# Altium project HAWACO_DATALOGER_DT-G2_V1.0.3.PrjPcb
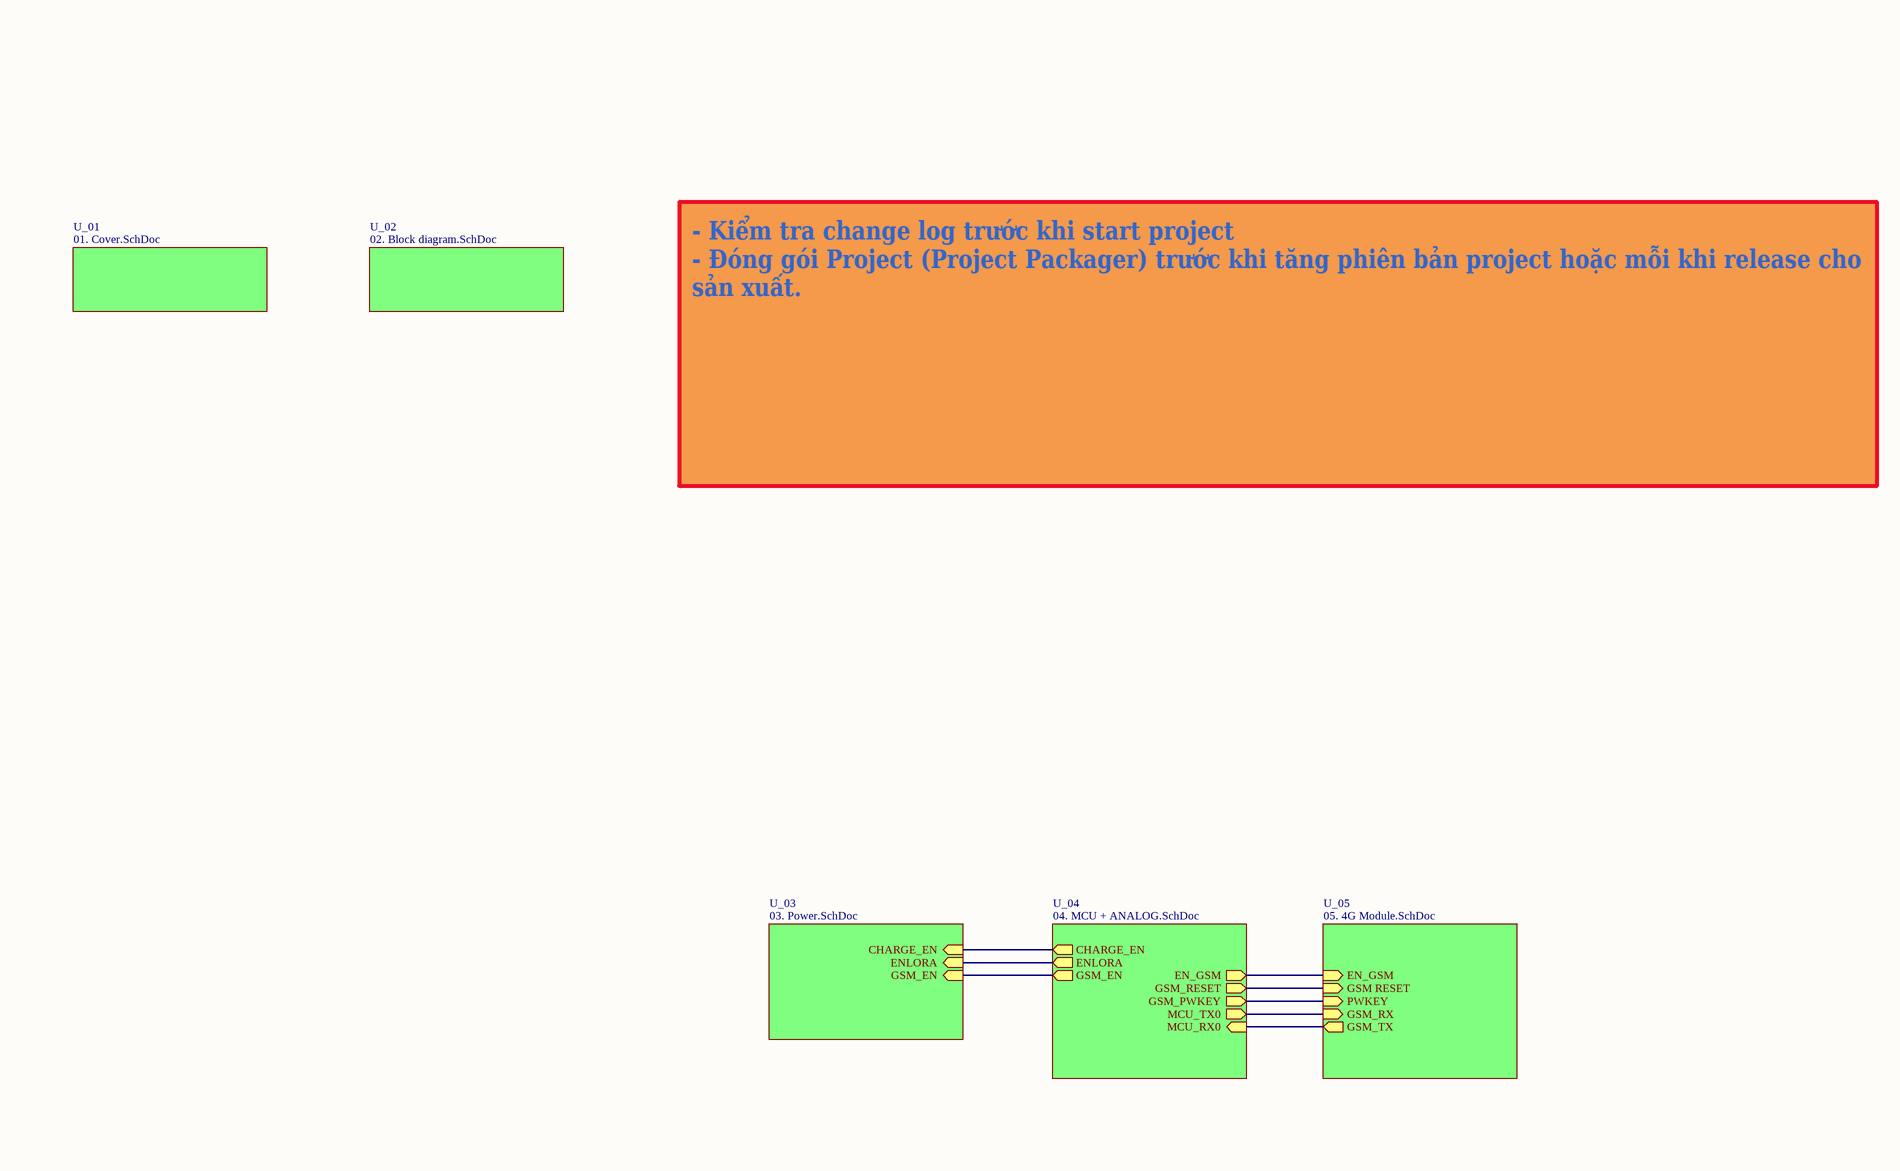
[diagram p0: 00. Root.SchDoc, left]
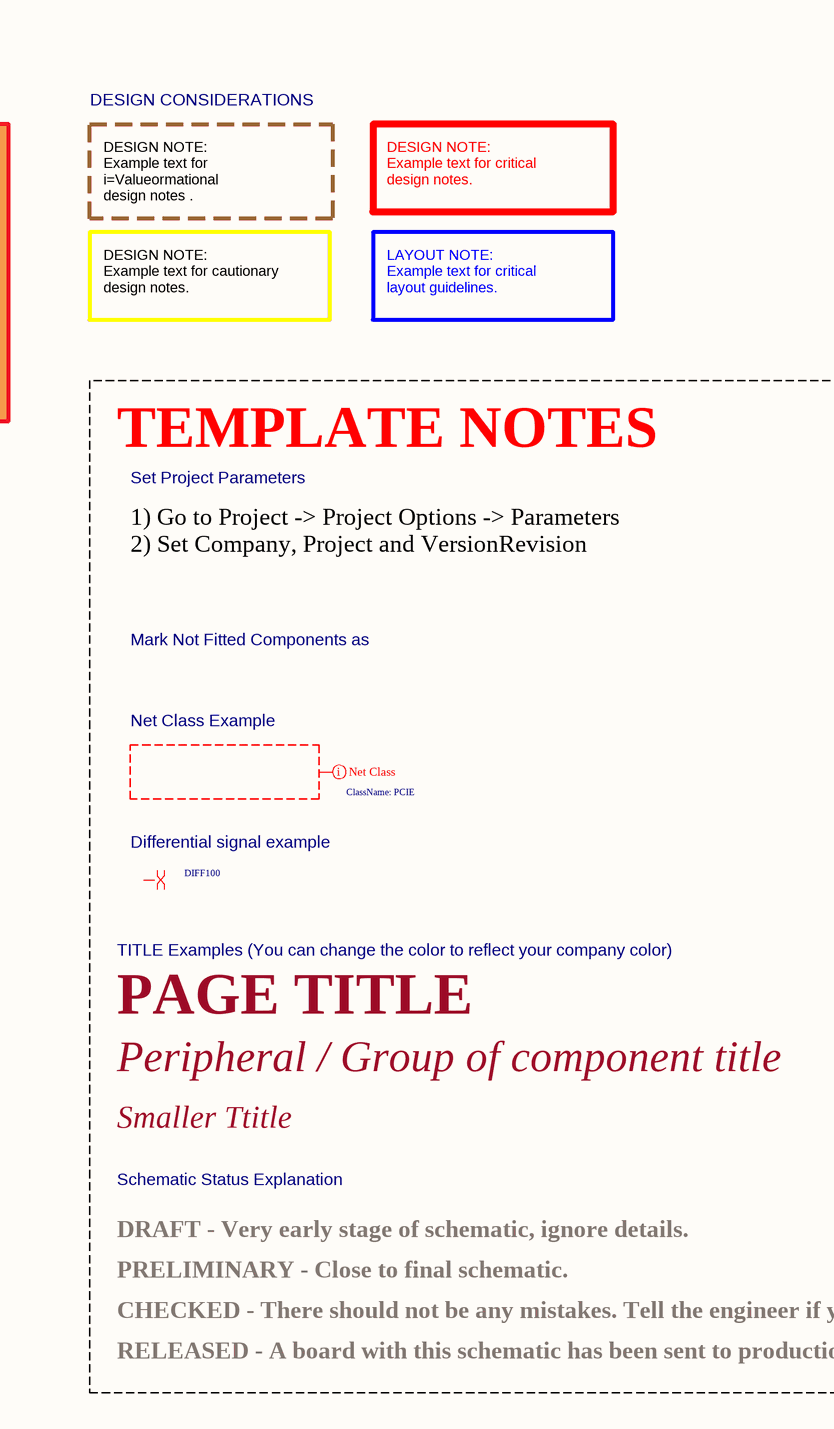
[diagram p1: 00. Root.SchDoc, right]
CURRENTREVISION: V1.0.3; globalprojectlink: HAWACO_DATALOGER_G2; GLOBALPROJECTTEAM: BUTPT
5 sheets, 286 parts. Net scope: hierarchical (ports join the sheet entries above them; power ports are global).
Board files: HAWACO_DATALOGER_DT-G2_PANEL.PcbDoc, HAWACO_DATALOGER_DT-G2_V1.0.3.PcbDoc
Sheets:
  00. Root.SchDoc
    U_01 = 01. Cover.SchDoc
    U_03 = 03. Power.SchDoc
    U_04 = 04. MCU + ANALOG.SchDoc
    U_05 = 05. 4G Module.SchDoc

## Sheet 00. Root.SchDoc
size A2

### Sub-sheets
U_01 = 01. Cover.SchDoc: no entries
U_02 = 02. Block diagram.SchDoc (file not in this document): no entries
U_03 = 03. Power.SchDoc: CHARGE_EN (in), ENLORA (in), GSM_EN (in)
U_04 = 04. MCU + ANALOG.SchDoc: GSM_PWKEY (out), GSM_EN (out), GSM_RESET (out), MCU_TX0 (out), MCU_RX0 (in), ENLORA (out), CHARGE_EN (out), EN_GSM (out)
U_05 = 05. 4G Module.SchDoc: GSM_RX (in), GSM_TX (out), GSM RESET (in), PWKEY (in), EN_GSM (in)

### Nets
EN_LORA: sheet U_03/ENLORA, sheet U_04/ENLORA
GSM1_RX: sheet U_04/MCU_TX0, sheet U_05/GSM_RX
GSM1_TX: sheet U_04/MCU_RX0, sheet U_05/GSM_TX
NetR3_2: sheet U_03/GSM_EN, sheet U_04/GSM_EN
NetR10_2: sheet U_03/CHARGE_EN, sheet U_04/CHARGE_EN
NetR28_1: sheet U_04/EN_GSM, sheet U_05/EN_GSM
NetR31_1: sheet U_04/GSM_RESET, sheet U_05/GSM RESET
NetR32_1: sheet U_04/GSM_PWKEY, sheet U_05/PWKEY

### Layout directives
net class PCIE: (no net found under the mark)
differential pair; net class DIFF100: (no net found under the mark)

### Notes on the sheet
- DESIGN CONSIDERATIONS
- DESIGN NOTE:
  Example text for i=Valueormational
  design notes .
- DESIGN NOTE:
  Example text for critical
  design notes.
- DESIGN NOTE:
  Example text for cautionary
  design notes.
- LAYOUT NOTE:
  Example text for critical
  layout guidelines.
- - Kiểm tra change log trước khi start project
  - Đóng gói Project (Project Packager) trước khi tăng phiên bản project hoặc mỗi khi release cho sản xuất.
- TEMPLATE NOTES
- Set Project Parameters
- 1) Go to Project -> Project Options -> Parameters
  2) Set Company, Project and VersionRevision
- Mark Not Fitted Components as
- Net Class Example
- Differential signal example
- TITLE Examples (You can change the color to reflect your company color)
- PAGE TITLE
- Peripheral / Group of component title
- Smaller Ttitle
- Schematic Status Explanation
- DRAFT - Very early stage of schematic, ignore details.
- PRELIMINARY - Close to final schematic.
- RELEASED - A board with this schematic has been sent to production.
- CHECKED - There should not be any mistakes. Tell the engineer if you find one.
- File:
- Project:
- REV:
- Sheet:
- Drawn By:
- Size:
- A2
- DRAFT
- Checked By:
- Approved By:

## Sheet 01. Cover.SchDoc
size A3
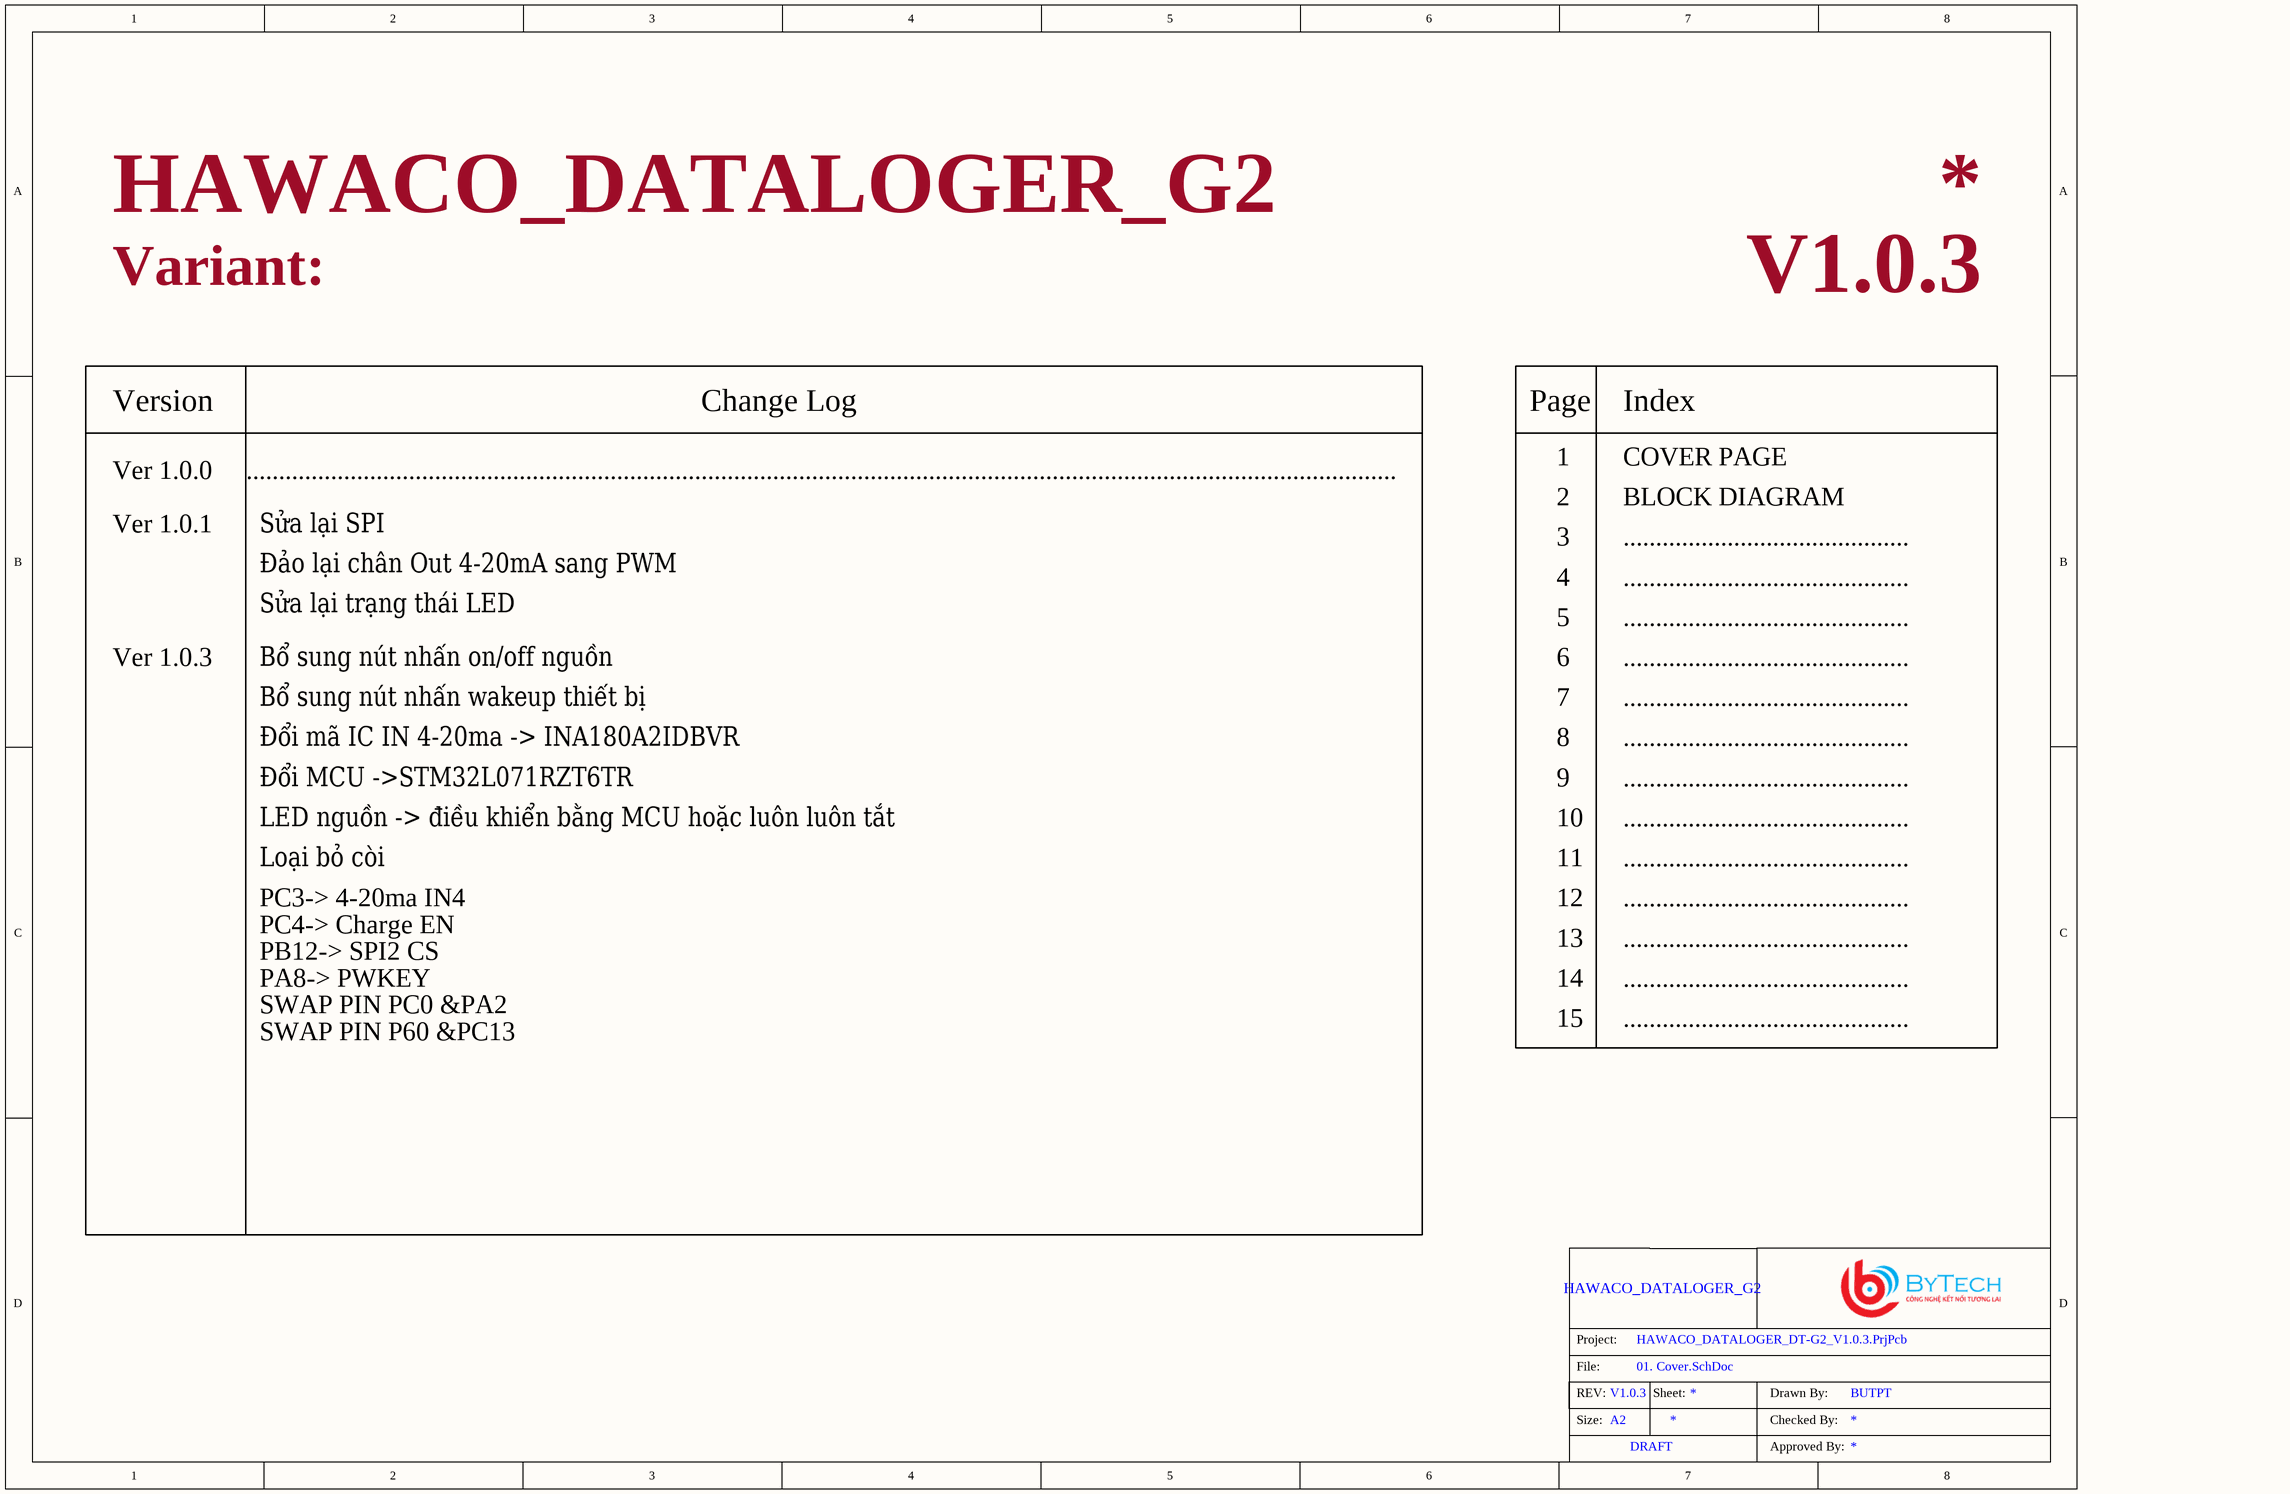
[diagram p2: 01. Cover.SchDoc]

### Notes on the sheet
- Variant:
- Version
- Change Log
- Page
- Index
- Ver 1.0.0
- .................................................................................................................................................................................
- 1
- 2
- COVER PAGE
- BLOCK DIAGRAM
- Ver 1.0.1
- Sửa lại SPI
- Đảo lại chân Out 4-20mA sang PWM
- 3
- ............................................
- Sửa lại trạng thái LED
- 4
- 5
- Ver 1.0.3
- Bổ sung nút nhấn on/off nguồn
- Bổ sung nút nhấn wakeup thiết bị
- 6
- 7
- Đổi mã IC IN 4-20ma -> INA180A2IDBVR
- 8
- Đổi MCU ->STM32L071RZT6TR
- LED nguồn -> điều khiển bằng MCU hoặc luôn luôn tắt
- 9
- 10
- Loại bỏ còi
- PC3-> 4-20ma IN4
- 11
- 12
- PC4-> Charge EN
- PB12-> SPI2 CS
- 13
- PA8-> PWKEY
- SWAP PIN PC0 &PA2
- SWAP PIN P60 &PC13
- 14
- 15
- File:
- Project:
- REV:
- Size:
- A2
- Sheet:
- Drawn By:
- Checked By:
- DRAFT
- Approved By:

## Sheet 03. Power.SchDoc
size A3
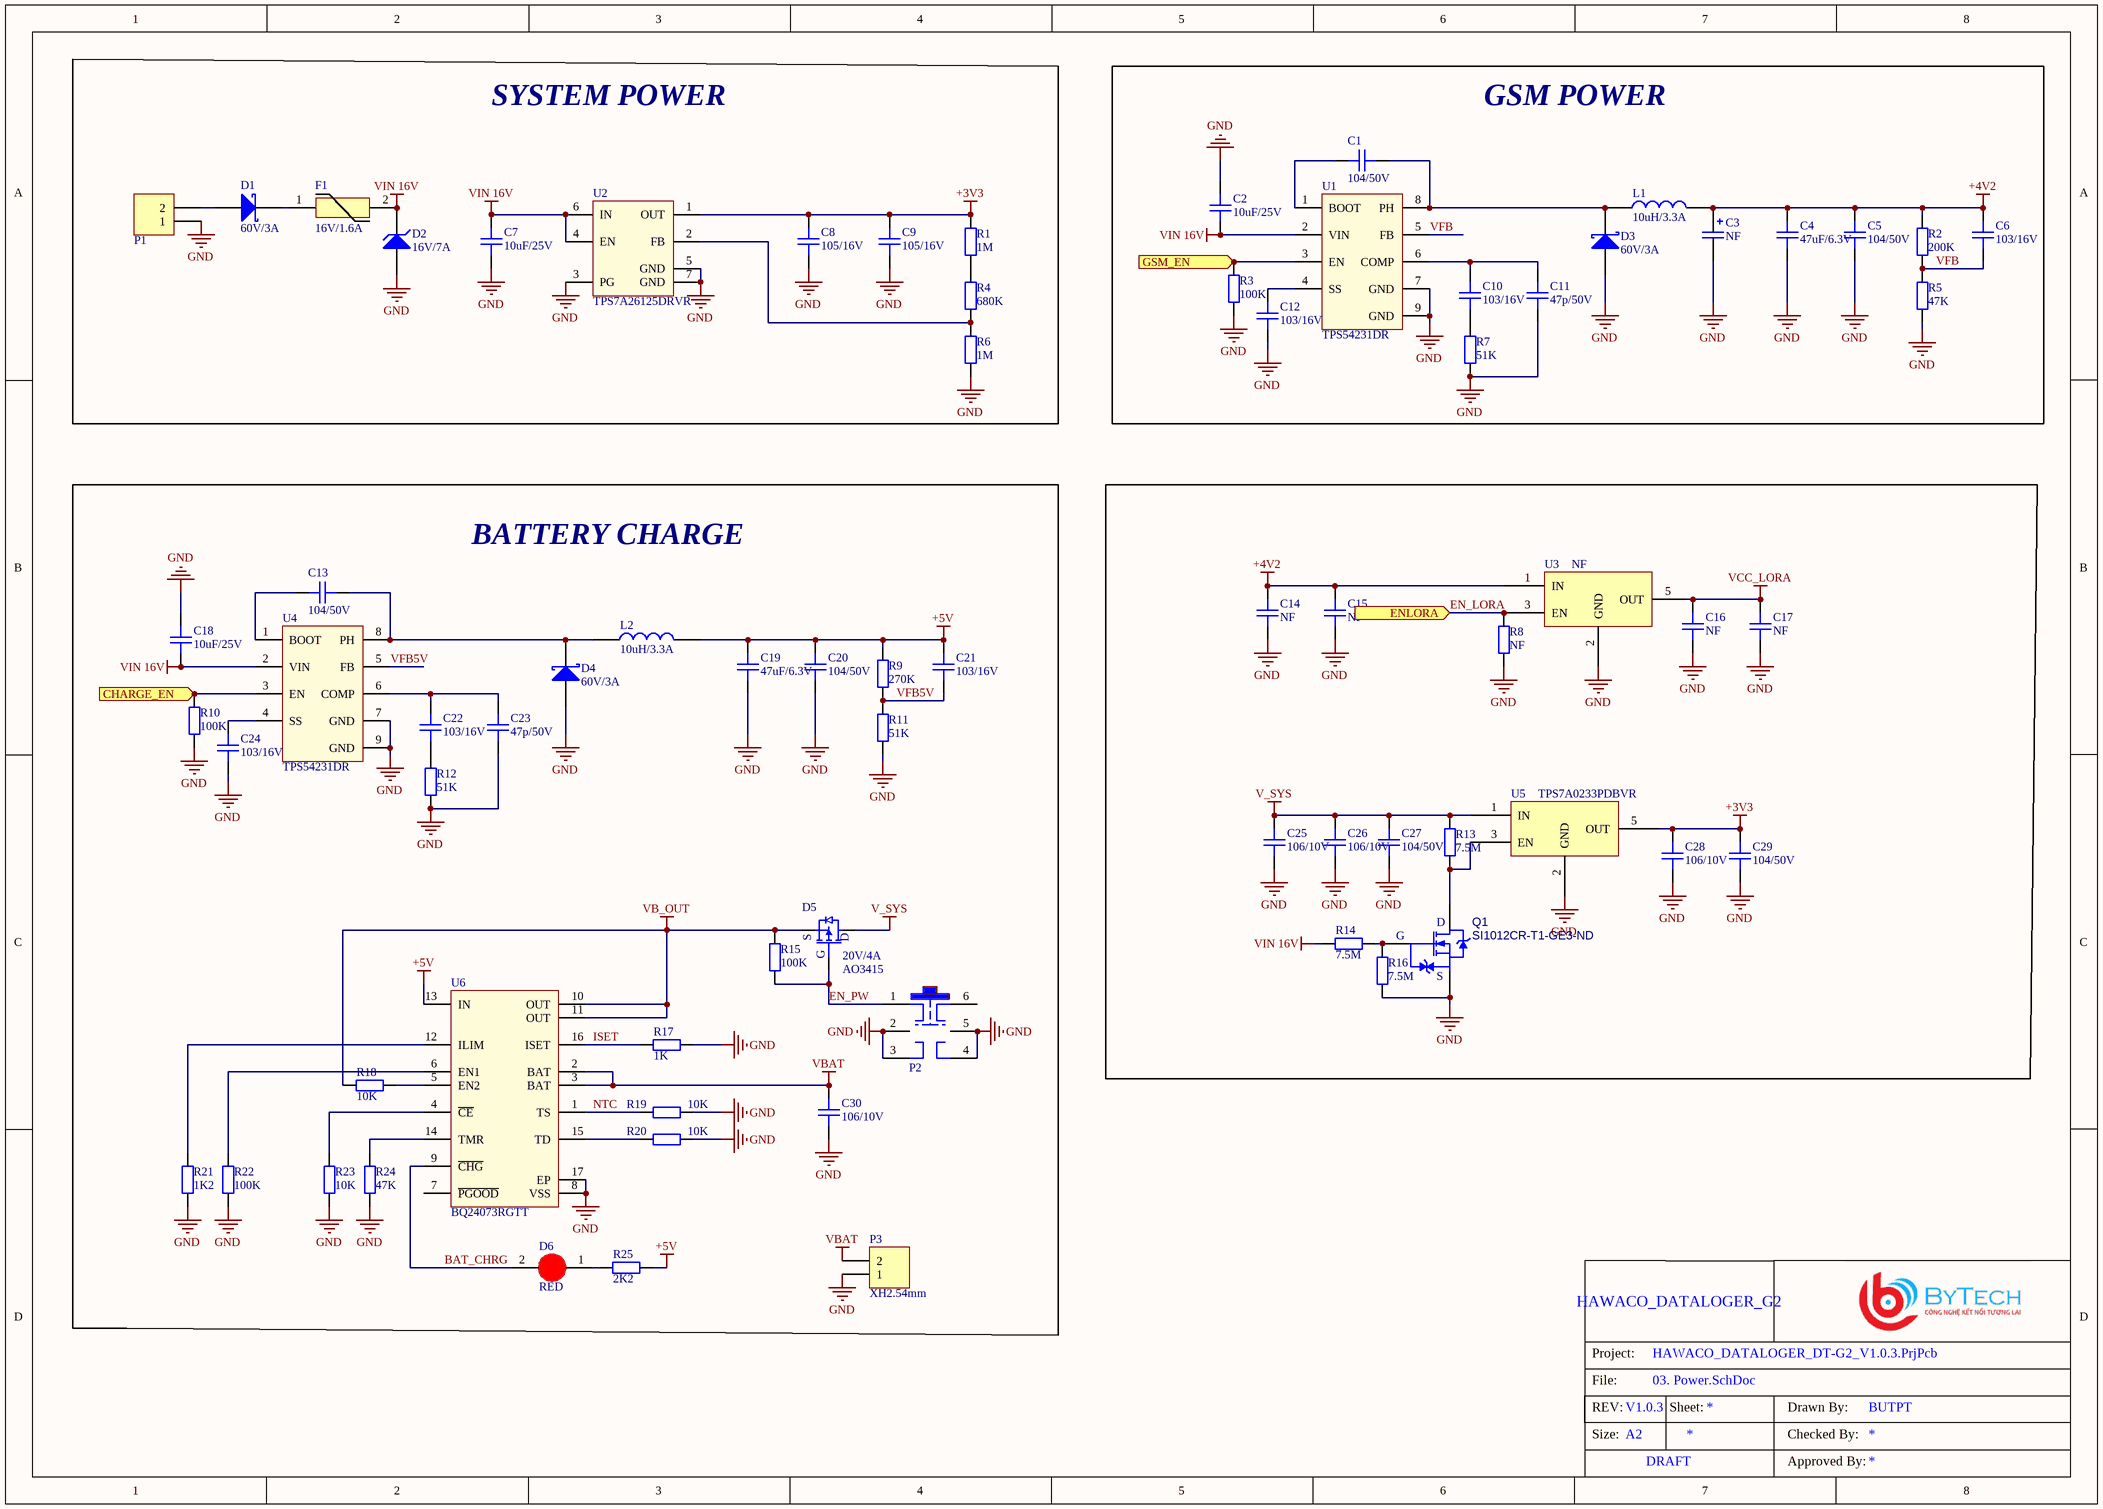
[diagram p3: 03. Power.SchDoc]

### Parts
C1  104/50V  [CAPC-0603 (1608)]
C2  10uF/25V  [CAPC-0805 (2012)]
C3  NF  [CAP_TANTAL_1210(3528)]
C4  47uF/6.3V  [CAPC-0603 (1608)]
C5  104/50V  [CAPC-0603 (1608)]
C6  103/16V  [CAPC-0603 (1608)]
C7  10uF/25V  [CAPC-0805 (2012)]
C8  105/16V  [CAPC-0603 (1608)]
C9  105/16V  [CAPC-0603 (1608)]
C10  103/16V  [CAPC-0603 (1608)]
C11  47p/50V  [CAPC-0603 (1608)]
C12  103/16V  [CAPC-0603 (1608)]
C13  104/50V  [CAPC-0603 (1608)]
C14  NF  [CAPC-0603 (1608)]
C15  NF  [CAPC-0603 (1608)]
C16  NF  [CAPC-0603 (1608)]
C17  NF  [CAPC-0603 (1608)]
C18  10uF/25V  [CAPC-0805 (2012)]
C19  47uF/6.3V  [CAPC-0603 (1608)]
C20  104/50V  [CAPC-0603 (1608)]
C21  103/16V  [CAPC-0603 (1608)]
C22  103/16V  [CAPC-0603 (1608)]
C23  47p/50V  [CAPC-0603 (1608)]
C24  103/16V  [CAPC-0603 (1608)]
C25  106/10V  [CAPC-0603 (1608)]
C26  106/10V  [CAPC-0603 (1608)]
C27  104/50V  [CAPC-0603 (1608)]
C28  106/10V  [CAPC-0603 (1608)]
C29  104/50V  [CAPC-0603 (1608)]
C30  106/10V  [CAPC-0603 (1608)]
D1  60V/3A  [DIODE_DO214AC_SMA]
D2  16V/7A  [SOD123]
D3  60V/3A  [DIODE_DO214AC_SMA]
D4  60V/3A  [DIODE_DO214AC_SMA]
D5  20V/4A  [SOT23_3]
D6  RED  [LED 0603]
F1  16V/1.6A  [FUSE_1812(4532)]
L1  10uH/3.3A  [IND-74404084150]
L2  10uH/3.3A  [IND-74404084150]
P1  15EDG3.81-2P  [HDR_3.81MM_RA_2x1]  (value not drawn)
P2  (no value)  [KFC8x8]
P3  XH2.54mm  [XH2.54-2P]
Q1  SI1012CR-T1-GE3-ND  [SOT-416]
R1  1M  [RESC-0603 (1608)]
R2  200K  [RESC-0603 (1608)]
R3  100K  [RESC-0603 (1608)]
R4  680K  [RESC-0603 (1608)]
R5  47K  [RESC-0603 (1608)]
R6  1M  [RESC-0603 (1608)]
R7  51K  [RESC-0603 (1608)]
R8  NF  [RESC-0603 (1608)]
R9  270K  [RESC-0603 (1608)]
R10  100K  [RESC-0603 (1608)]
R11  51K  [RESC-0603 (1608)]
R12  51K  [RESC-0603 (1608)]
R13  7.5M  [RESC-0603 (1608)]
R14  7.5M  [RESC-0603 (1608)]
R15  100K  [RESC-0603 (1608)]
R16  7.5M  [RESC-0603 (1608)]
R17  1K  [RESC-0603 (1608)]
R18  10K  [RESC-0603 (1608)]
R19  10K  [RESC-0603 (1608)]
R20  10K  [RESC-0603 (1608)]
R21  1K2  [RESC-0603 (1608)]
R22  100K  [RESC-0603 (1608)]
R23  10K  [RESC-0603 (1608)]
R24  47K  [RESC-0603 (1608)]
R25  2K2  [RESC-0603 (1608)]
U1  TPS54231DR  [SOIC8 - TP]
U2  TPS7A26125DRVR  [WSON6]
U3  NF  [SOT23-5]
U4  TPS54231DR  [SOIC8 - TP]
U5  TPS7A0233PDBVR  [SOT23-5]
U6  BQ24073RGTT  [RGT16-1700X1700TP]

### Blocks framed on the sheet
SYSTEM POWER: C7-C9 D1 D2 F1 P1 R1 R4 R6 U2
GSM POWER: C1-C6 C10-C12 D3 L1 R2 R3 R5 R7 U1
BATTERY CHARGE: C13 C18-C24 C30 D4-D6 L2 P2 P3 R9-R12 R15 R17-R25 U4 U6

### Ports
CHARGE_EN (in), ENLORA (in), GSM_EN (in)

### Nets
+3V3: C8.2 C9.2 C28.2 C29.2 R1.2 U2.1(OUT) U5.5(OUT)
+4V2: C3.1 C4.2 C5.2 C6.2 C14.2 C15.2 L1.2 R2.2 U3.1(IN)
+5V: C19.2 C20.2 C21.2 L2.2 R9.2 R25.2 U6.13(IN)
GND: C2.1 C3.2 C4.1 C5.1 C7.1 C8.1 C9.1 C11.1 C12.2 C14.1 C15.1 C16.1 C17.1 C18.1 C19.1 C20.1 C23.1 C24.2 C25.1 C26.1 C27.1 C28.1 C29.1 C30.1 D2.1(A) D3.1(A) D4.1(A) P1.1 P2.2 P2.3 P2.4 P2.5 P3.1 Q1.2(S) R3.1 R5.1 R6.1 R7.1 R8.1 R10.1 R11.1 R12.1 R16.1 R17.2 R19.2 R20.2 R21.1 R22.1 R23.1 R24.1 U1.7(GND) U1.9(GND) U2.3(PG) U2.5(GND) U2.7(GND) U3.2(GND) U4.7(GND) U4.9(GND) U5.2(GND) U6.8(VSS) U6.17(EP)
V_SYS: C25.2 C26.2 C27.2 D5.3(D) R13.2 U5.1(IN)
VB_OUT: D5.2(S) R15.2 R18.1 U6.10(OUT) U6.11(OUT)
VBAT: C30.2 P3.2 U6.2(BAT) U6.3(BAT)
VCC_LORA: C16.2 C17.2 U3.5(OUT)
VIN 16V: C2.2 C7.2 C18.2 D2.2(K) F1.2 R14.2 U1.2(VIN) U2.4(EN) U2.6(IN) U4.2(VIN)
BAT_CHRG: D6.2(K) U6.9(~{CHG})
EN_LORA: R8.2 U3.3(EN) ; port ENLORA
EN_PW: D5.1(G) P2.1 R15.1
ISET: R17.1 U6.16(ISET)
NTC: R19.1 U6.1(TS)
VFB: C6.1 R2.1 R5.2 U1.5(FB)
VFB5V: C21.1 R9.1 R11.2 U4.5(FB)
NetC1_1: C1.1 U1.1(BOOT)
NetC1_2: C1.2 D3.2(K) L1.1 U1.8(PH)
NetC10_1: C10.1 C11.2 U1.6(COMP)
NetC10_2: C10.2 R7.2
NetC12_1: C12.1 U1.4(SS)
NetC13_1: C13.1 U4.1(BOOT)
NetC13_2: C13.2 D4.2(K) L2.1 U4.8(PH)
NetC22_1: C22.1 C23.2 U4.6(COMP)
NetC22_2: C22.2 R12.2
NetC24_1: C24.1 U4.4(SS)
NetD1_1: D1.1(A) P1.2
NetD1_2: D1.2(K) F1.1
NetD6_1: D6.1(A) R25.1
NetQ1_1: Q1.1(G) R14.1 R16.2
NetQ1_3: Q1.3(D) R13.1 U5.3(EN)
NetR1_1: R1.1 R4.2
NetR3_2: R3.2 U1.3(EN) ; port GSM_EN
NetR4_1: R4.1 R6.2 U2.2(FB)
NetR10_2: R10.2 U4.3(EN) ; port CHARGE_EN
NetR18_2: R18.2 U6.5(EN2)
NetR20_1: R20.1 U6.15(TD)
NetR21_2: R21.2 U6.12(ILIM)
NetR22_2: R22.2 U6.6(EN1)
NetR23_2: R23.2 U6.4(~{CE})
NetR24_2: R24.2 U6.14(TMR)

Not connected (* = marked no-connect by the designer): P2 6; U6 7(~{PGOOD})

### Notes on the sheet
- File:
- Project:
- REV:
- Size:
- A2
- Sheet:
- Drawn By:
- Checked By:
- DRAFT
- Approved By:

### Library data of the parts
C1 C5 C13 C20 C27 C29 = C0603C104K5RACTU: CAP CER 0.1uF 50V 10% X7R 0603; CompanyID: VT-00982; Solder: SMT; MPN: C0603C104K5RACTU; Value: 104/50V; Category: CAPACITOR
C2 C7 C18 = GMC21X5R106K25NT: CAP0805 X5R 10UF 10% 25V; MFR: CAL-CHIP ELECTRONICS, INC.; Solder: SMT; Value: 10uF/25V; MPN: GMC21X5R106K25NT; Category: Capacitor
C3 = T520B227M006ATE035: CAP TANT POLY 220uF 20% 6.3V 3528 35mOhm ESR; Solder: SMT; Value: 227/6.3V; CompanyID: VT-00643; MPN: T520B227M006ATE035
C4 C19 = GRM188R60J476ME15D: CAP CER 47UF 6.3V X5R 0603; MFR: Murata Electronics; MPN: GRM188R60J476ME15D; Value: 47uF/6.3V; Category: CAPACITOR; SOLDER: CAP-0603
C6 C21 = CC0603KRX7R7BB103: CAP CER 10nF 16V 10% X7R 0603; CompanyID: VT-00592; Solder: SMT; MPN: CC0603KRX7R7BB103; Value: 103/16V; Category: CAPACITOR
C8 C9 = CC0603KRX7R7BB105: CAP CER 1uF 10% 16V X7R 0603; Solder: SMT; Company ID: VT00032; Value: 105/16V; MPN: CC0603KRX7R7BB105
C10 C12 C22 C24 = CC0603KRX7R7BB103: CAP CER 10nF 16V 10% X7R 0603; Solder: SMT; Company ID: VT00031; MPN: CC0603KRX7R7BB103; Value: 103/16V
C11 C23 = CL10C470JB8NNNC: CAP CER 47pF 5% 50V C0G/NP0 0603; Solder: SMT; MPN: CL10C470JB8NNNC; Value: 47p/50V
C14 C16 = CL10A106KP8NNNC: CAP CER 10uF 10% 10V X5R 0603; Solder: SMT; Value: 106/10V; MPN: CL10A106KP8NNNC
C15 C17 = C0603C104K5RACTU: CAP CER 0.1uF 50V 10% X7R 0603; CompanyID: VT-00982; Solder: SMT; Value: 104/50V; MPN: C0603C104K5RACTU; Category: CAPACITOR
C25 C26 C28 = CL10A106KP8NNNC: CAP CER 10uF 10% 10V X5R 0603; Solder: SMT; MPN: CL10A106KP8NNNC; Value: 106/10V
C30 = CL10A106KP8NNNC: CAP CER 10uF 10% 10V X5R 0603; CompanyID: VT-00984; Solder: SMT; MPN: CL10A106KP8NNNC; Value: 106/10V
D1 = SK36A-LTP: DIODE SCHOTTKY 60V 3A DO214AC; MPN: SK36A-LTP; Category: Diode; Solder: DO214AC; Value: 60V/3A
D2 = 1SMF16BT3: TVS DIODE 16VWM 26VC SOD123FL; MFR: ON Semiconductor; Solder: SOD-123FL; MPN: 1SMF16BT3; Value: 16V/7A; Category: DIODE
D3 D4 = SK36A-LTP: DIODE SCHOTTKY 60V 3A DO214AC; Manufacturer: Micro Commercial Co; MPN: SK36A-LTP; Category: Diode; Solder: DO214AC; Value: 60V/3A
D5 = AO3415: MOSFET P-CH 20V 4A SOT23; MFR: Alpha & Omega Semiconductor Inc.; Company ID: VT00490; CATEGORY: DIODE; SOLDER: SOT23; VALUE: 20V/4A; MPN: AO3415
D6 = LED 0603 RED: Solder: 0603; Company ID: VT00361; MPN: LED 0603 RED; Category: LED Diode; Value: RED
F1 = MPTS1812L16016R: PTC RESET FUSE 16V 1.6A 1812; MFR: Meritek; MPN: MPTS1812L16016R; Solder: SMT 1812; Value: 16V/1.6A
L1 L2 = SWPA8040S100MT: FIXED IND 10UH 3.3A 38 MOHM SMD; MFR: Shenzhen Sunlord Electronics Co., Ltd.; DCR: 38mOhm; MPN: SWPA8040S100MT; VALUE: 10uH/3.3A; CATEGORY: INDUCTOR
P1 = 15EDG3.81-2P: Pluggable terminal 15EDG- 2P 3.81MM; MFR: China; Solder: Hand; MPN: 15EDG3.81-2P; Value: 15EDG3.81-2P; Company ID: *; MPN2: CLA5048
P2 = KFC8X8: Self-locking button 6p 8x8mm; MFR: China; Solder: Wave; MPN: KFC8X8; Category: Button; URL: http://linhkienchatluong.vn/cac-loai-khac/nut-nhan-8x8mm-6-chan-nhan-giu_sp695_ct1851.aspx; URL2: https://detail.tmall.com/item.htm?spm=a230r.1.14.19.6b277f95Qx3STz&id=576968696503&ns=1&abbucket=2
P3 = XH-2A: XH2.54mmm - 2P 180 degree; MPN: XH-2A; Value: XH2.54mm
Q1 = SI1012CR-T1-GE3-ND: MOSFET N-CH 20V 0.63A SC-75A; Solder: SMT; MPN: SI1012CR-T1-GE3-ND; Value: SI1012CR-T1-GE3-ND
R1 R6 = CRCW06031M00FKEA: RES SMD 1M OHM 1% 1/10W 0603; Solder: SMT; Company ID: VT00405; MPN: CRCW06031M00FKEA; Value: 1M
R2 = CR0603-FX-2003ELF: RES SMD 200K OHM 1% 1/10W 0603; MPN: CR0603-FX-2003ELF; VALUE: 200K; Category: Resistor
R3 R8 R10 R15 = RC0603FR-07100KL: RES SMD 100K OHM 1% 1/10W 0603; Solder: SMT; Company ID: VT00424; MPN: RC0603FR-07100KL; Value: 100K
R4 = RT0603FRE07680KL: RES SMD 680K OHM 1% 1/10W 0603; MFR: YAGEO; Solder: SMT; MPN: RT0603FRE07680KL; Value: 680K
R5 = RC0603FR0747KL: RES SMD 47K OHM 1% 1/10W 0603; Solder: SMT; Value: 47K; MPN: RC0603FR0747KL
R7 R11 R12 = RC0603FR-0751KL: RES SMD 51K OHM 1% 1/10W 0603; MFR: Yageo; Company ID: VT00453; Value: 51K; Category: Resistor; MPN: RC0603FR-0751KL; Solder: RES-0603
R9 = RT0603BRD07270KL: RES SMD 270K OHM 0.1% 1/10W 0603; Company ID: VT00474; value: 270K; MPN: RT0603BRD07270KL
R13 R14 R16 = RC0603FR-077M5L: RES SMD 7.5M OHM 1% 1/10W 0603; Solder: SMT; MPN: RC0603FR-077M5L; Value: 7.5M
R17 = RC0603FR-071KL: RES SMD 1 KOHM 1% 1/10W 0603; Solder: SMT; Company ID: VT00433; MPN: RC0603FR-071KL; Value: 1K
R18-R20 R23 = RC0603FR-0710KL: RES SMD 10K OHM 1% 1/10W 0603; CompanyID: VT-00328; Solder: SMT; MPN: RC0603FR-0710KL; Value: 10K
R21 = RC0603FR-071K2L: RES SMD 1.2K OHM 1% 1/10W 0603; CompanyID: VT-01075; Solder: SMT; Value: 1K2; MPN: RC0603FR-071K2L
R22 = RC0603FR-07100KL: RES SMD 100K OHM 1% 1/10W 0603; Solder: SMT; CompanyID: VT-00332; MPN: RC0603FR-07100KL; Value: 100K
R24 = RC0603FR0747KL: RES SMD 47K OHM 1% 1/10W 0603; CompanyID: VT-00322; Solder: SMT; Value: 47K; MPN: RC0603FR0747KL
R25 = CRCW06032K20FKEA: RES SMD 2.2K OHM 1% 1/10W 0603; Solder: SMT; Company ID: VT00406; MPN: CRCW06032K20FKEA; Value: 2K2
U1 U4 = TPS54231DR: IC REG BUCK ADJUSTABLE 2A 8SOIC; MFR: TI; SOLDER: SOIC8; MPN: TPS54231DR; CATEGORY: IC; VALUE: TPS54231DR
U2 = TPS7A26125DRVR: IC REG LINEAR 1.25V 500MA 6WSON; MFR: TI; MPN: TPS7A26125DRVR; CATEGORY: IC; VALUE: TPS7A26125DRVR; SOLDER: 6WSON; Company ID: *
U3 U5 = TPS7A0233PDBVR: NANOPOWER LDO; Current - Quiescent: 60nA; MPN: TPS7A0233PDBVR; Category: IC; Solder: SOT23-5; Value: TPS7A0233PDBVR
U6 = BQ24073RGTT: IC LI-ION CHARGE/PWR MGMT 16-QFN; MFR: Texas Instruments; Solder: 16-QFN (3x3); Company ID: VT00206; MPN: BQ24073RGTT; Category: IC; Value: BQ24073RGTT

## Sheet 04. MCU + ANALOG.SchDoc
size A2
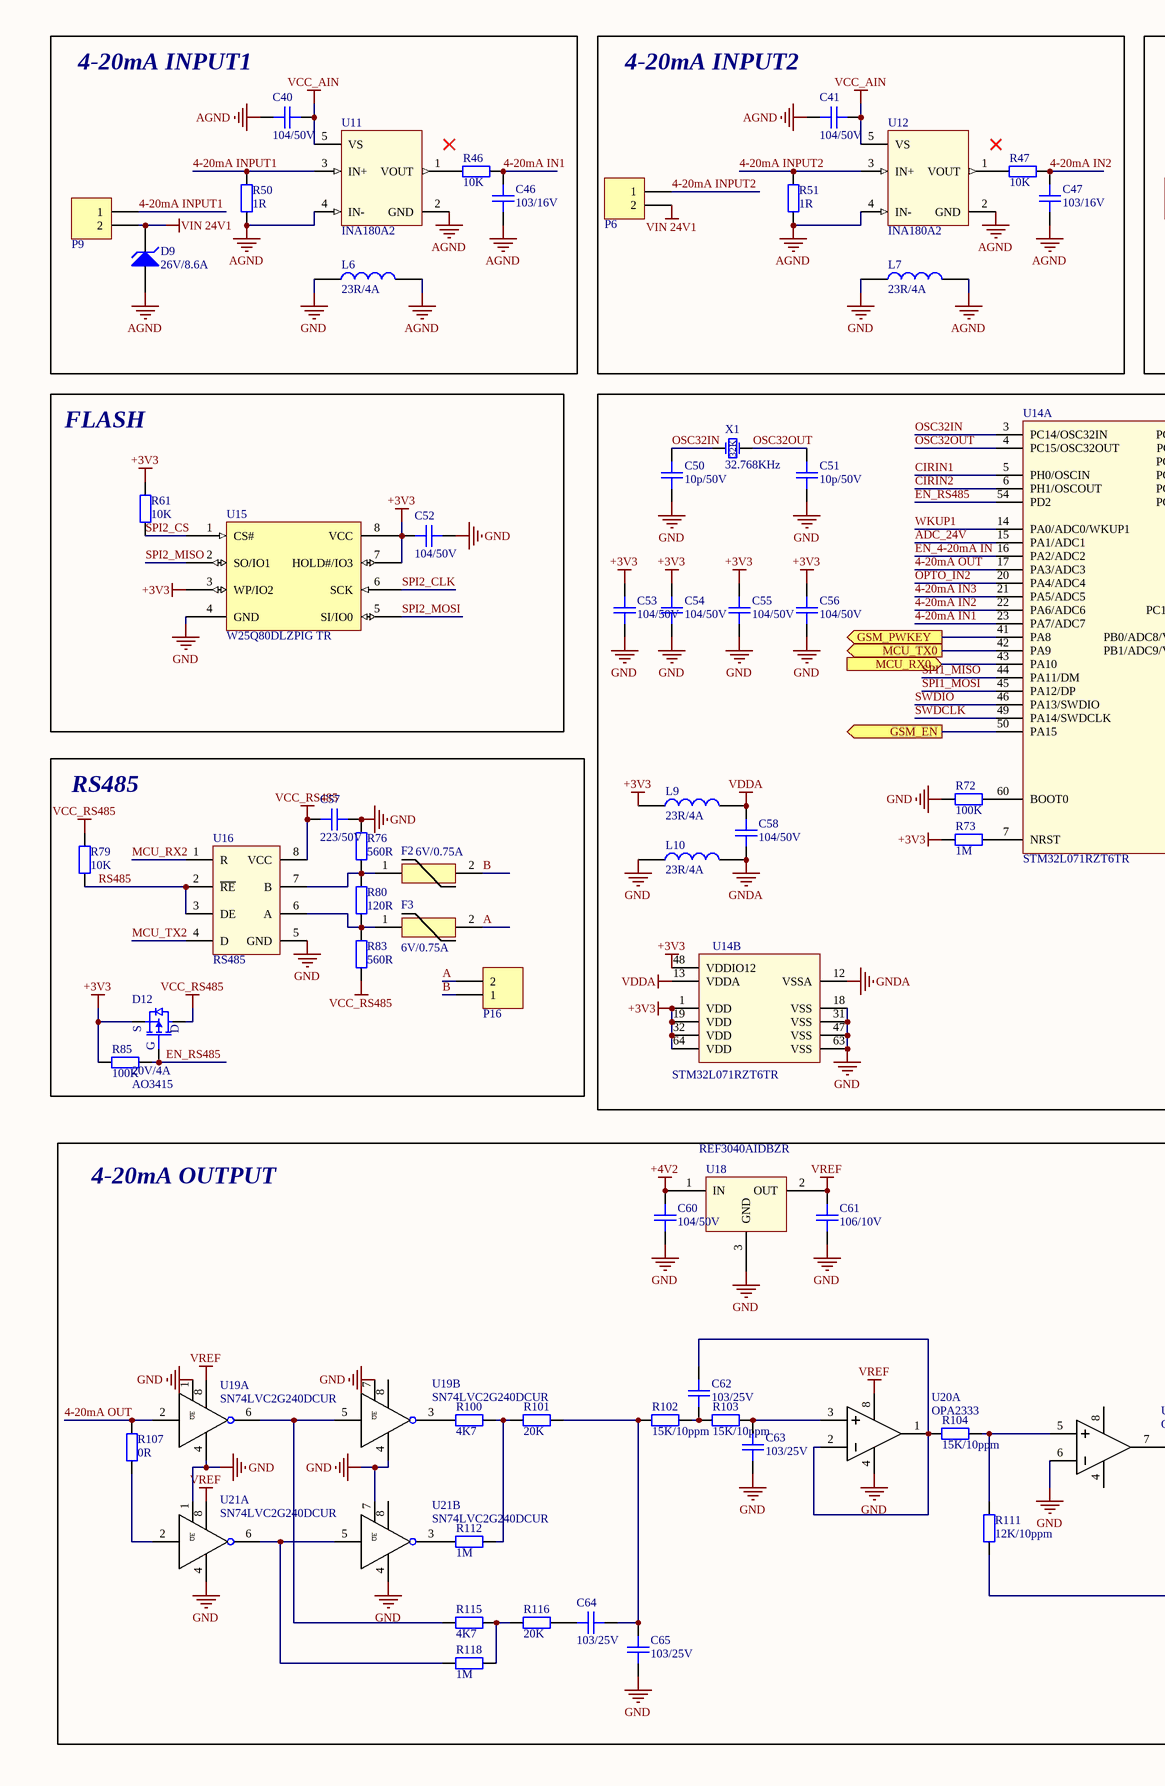
[diagram p4: 04. MCU + ANALOG.SchDoc, left]
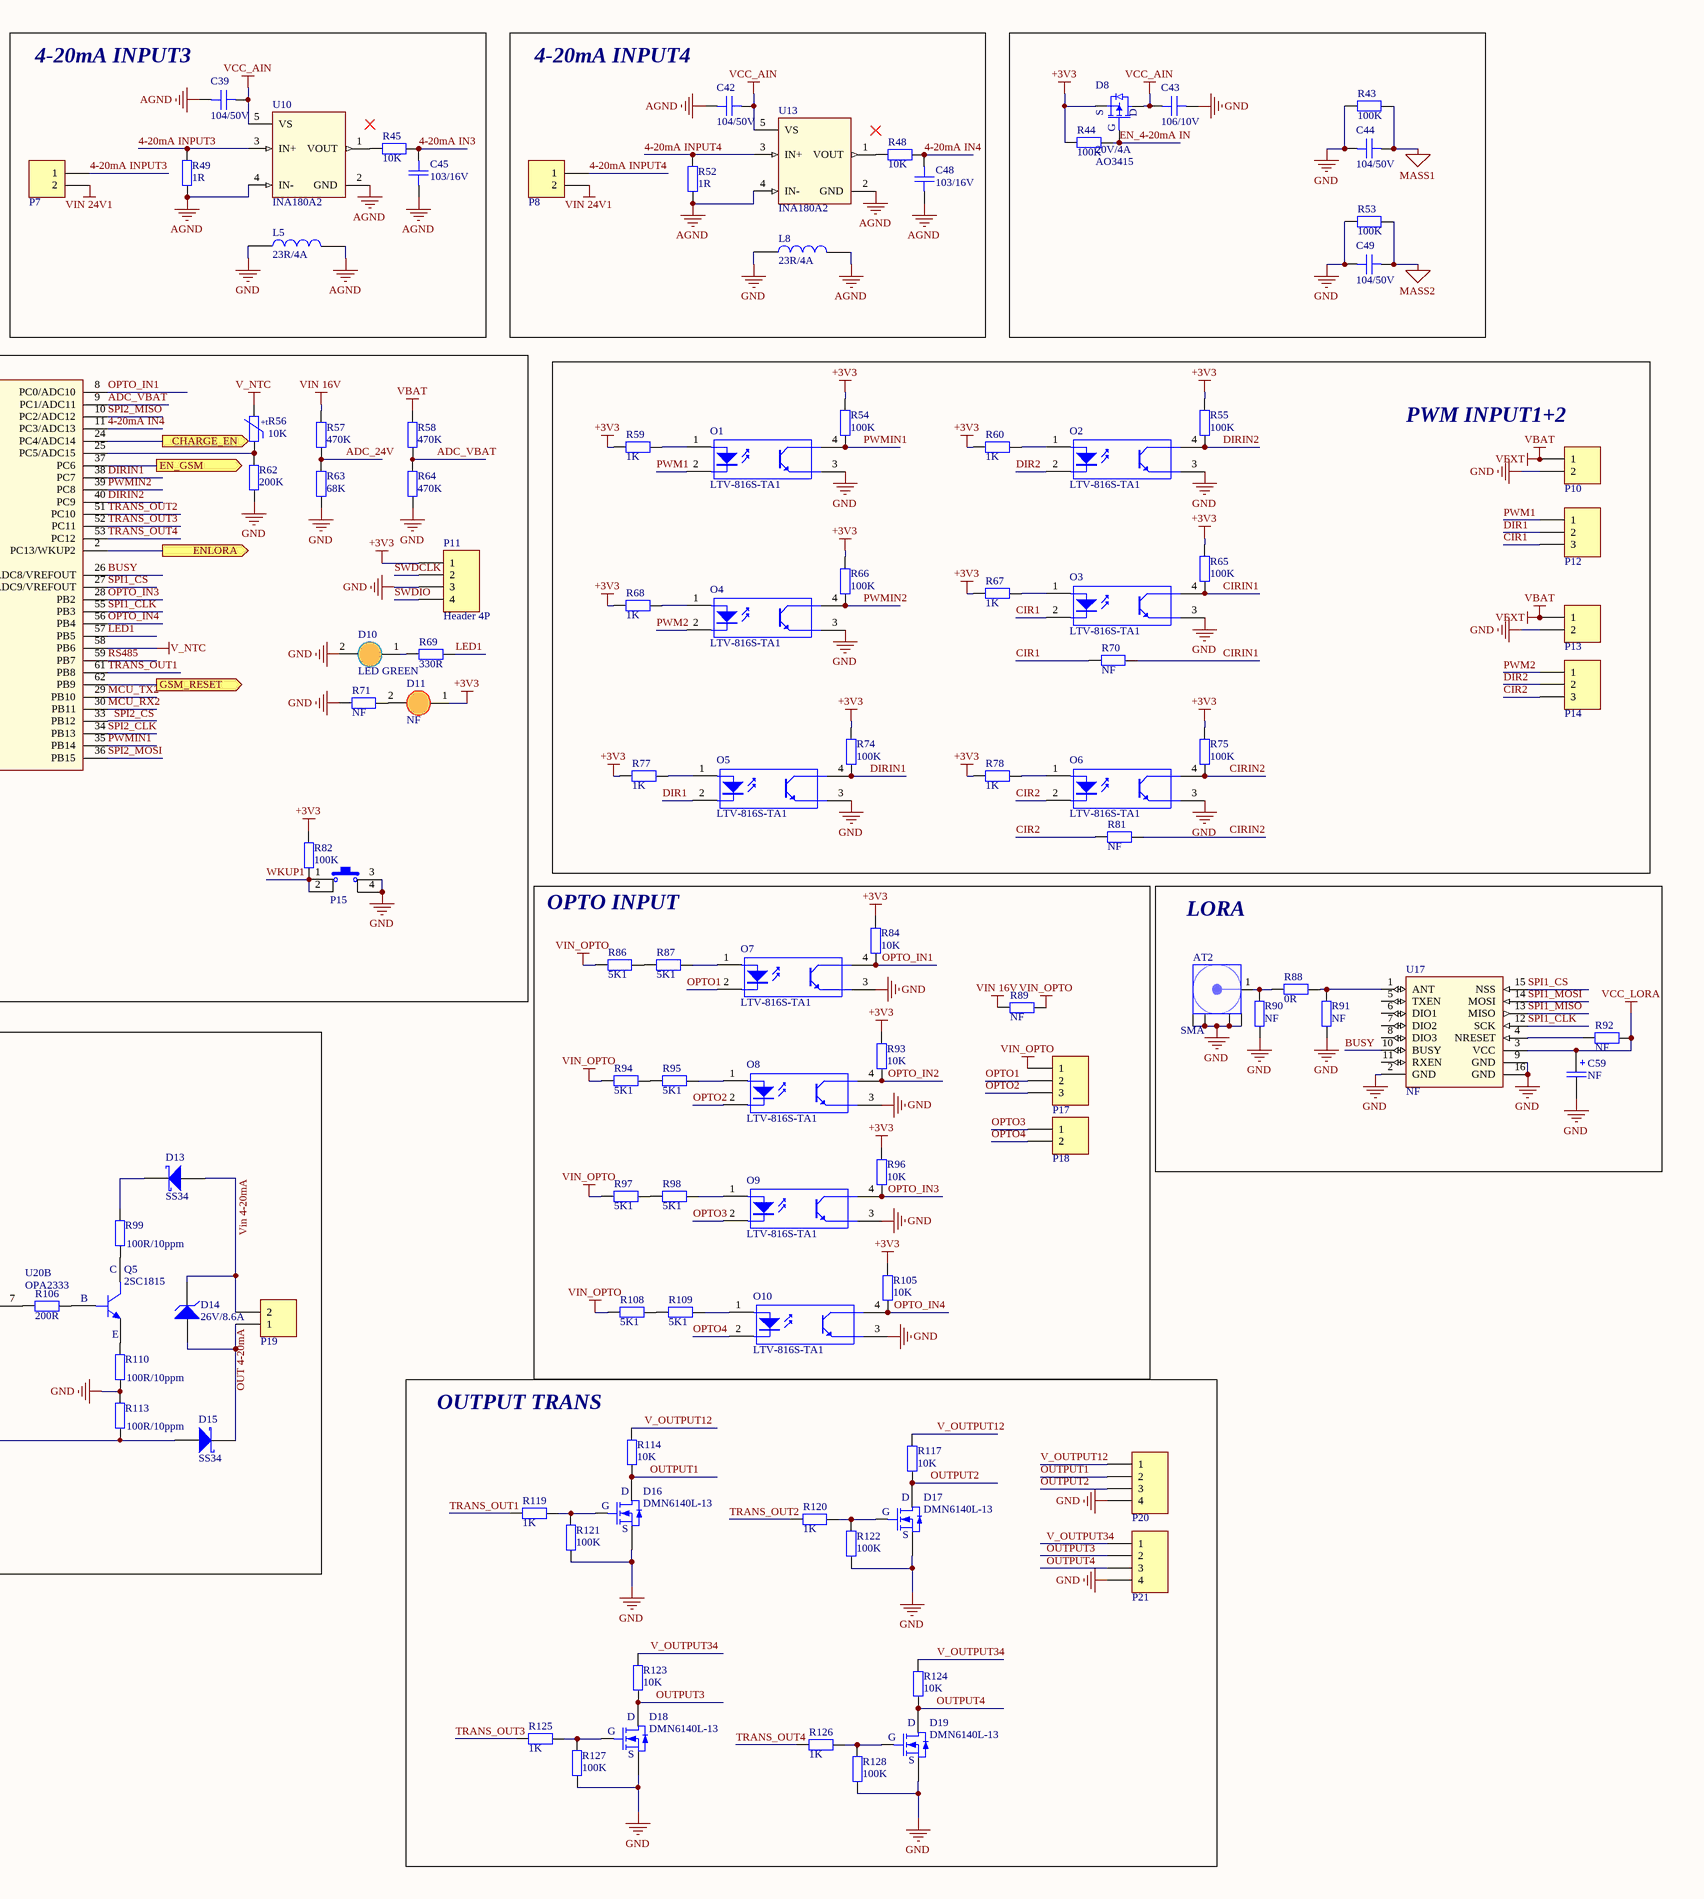
[diagram p5: 04. MCU + ANALOG.SchDoc, right]

### Parts
AT2  SMA  [SMA-KWE-17-V1]
C39  104/50V  [CAPC-0603 (1608)]
C40  104/50V  [CAPC-0603 (1608)]
C41  104/50V  [CAPC-0603 (1608)]
C42  104/50V  [CAPC-0603 (1608)]
C43  106/10V  [CAPC-0603 (1608)]
C44  104/50V  [CAPC-0603 (1608)]
C45  103/16V  [CAPC-0603 (1608)]
C46  103/16V  [CAPC-0603 (1608)]
C47  103/16V  [CAPC-0603 (1608)]
C48  103/16V  [CAPC-0603 (1608)]
C49  104/50V  [CAPC-0603 (1608)]
C50  10p/50V  [CAPC-0603 (1608)]
C51  10p/50V  [CAPC-0603 (1608)]
C52  104/50V  [CAPC-0603 (1608)]
C53  104/50V  [CAPC-0603 (1608)]
C54  104/50V  [CAPC-0603 (1608)]
C55  104/50V  [CAPC-0603 (1608)]
C56  104/50V  [CAPC-0603 (1608)]
C57  223/50V  [CAPC-0603 (1608)]
C58  104/50V  [CAPC-0603 (1608)]
C59  NF  [CAP_TANTAL_1210(3528)]
C60  104/50V  [CAPC-0603 (1608)]
C61  106/10V  [CAPC-0603 (1608)]
C62  103/25V  [CAPC-0603 (1608)]
C63  103/25V  [CAPC-0603 (1608)]
C64  103/25V  [CAPC-0603 (1608)]
C65  103/25V  [CAPC-0603 (1608)]
D8  20V/4A  [SOT23_3]
D9  26V/8.6A  [DIODE_DO214AC_SMA]
D10  LED GREEN  [LED_3MM-GREEN]
D11  NF  [LED_3MM-RED]
D12  20V/4A  [SOT23_3]
D13  SS34  [DIODE_DO214AC_SMA]
D14  26V/8.6A  [DIODE_DO214AC_SMA]
D15  SS34  [DIODE_DO214AC_SMA]
D16  DMN6140L-13  [SOT23_3]
D17  DMN6140L-13  [SOT23_3]
D18  DMN6140L-13  [SOT23_3]
D19  DMN6140L-13  [SOT23_3]
F2  6V/0.75A  [FUSE 0ZCK_BEL]
F3  6V/0.75A  [FUSE 0ZCK_BEL]
L5  23R/4A  [IND-0603 (1608)]
L6  23R/4A  [IND-0603 (1608)]
L7  23R/4A  [IND-0603 (1608)]
L8  23R/4A  [IND-0603 (1608)]
L9  23R/4A  [IND-0603 (1608)]
L10  23R/4A  [IND-0603 (1608)]
O1  LTV-816S-TA1  [OPTO 1]
O2  LTV-816S-TA1  [OPTO 1]
O3  LTV-816S-TA1  [OPTO 1]
O4  LTV-816S-TA1  [OPTO 1]
O5  LTV-816S-TA1  [OPTO 1]
O6  LTV-816S-TA1  [OPTO 1]
O7  LTV-816S-TA1  [OPTO 1]
O8  LTV-816S-TA1  [OPTO 1]
O9  LTV-816S-TA1  [OPTO 1]
O10  LTV-816S-TA1  [OPTO 1]
P6  15EDG3.81-2P  [HDR_3.81MM_RA_2x1]  (value not drawn)
P7  15EDG3.81-2P  [HDR_3.81MM_RA_2x1]  (value not drawn)
P8  15EDG3.81-2P  [HDR_3.81MM_RA_2x1]  (value not drawn)
P9  15EDG3.81-2P  [HDR_3.81MM_RA_2x1]  (value not drawn)
P10  15EDG3.81-2P  [HDR_3.81MM_RA_2x1]  (value not drawn)
P11  Header 4P  [HDR1X4]
P12  15EDG3.81-3P  [HDR_3.81MM_RA_3x1]  (value not drawn)
P13  15EDG3.81-2P  [HDR_3.81MM_RA_2x1]  (value not drawn)
P14  15EDG3.81-3P  [HDR_3.81MM_RA_3x1]  (value not drawn)
P15  (no value)  [BUTTON 4P_6X6]
P16  15EDG3.81-2P  [HDR_3.81MM_RA_2x1]  (value not drawn)
P17  15EDG3.81-3P  [HDR_3.81MM_RA_3x1]  (value not drawn)
P18  15EDG3.81-2P  [HDR_3.81MM_RA_2x1]  (value not drawn)
P19  15EDG3.81-2P  [HDR_3.81MM_RA_2x1]  (value not drawn)
P20  15EDG3.81-4P  [HDR_3.81MM_RA_4X1]  (value not drawn)
P21  15EDG3.81-4P  [HDR_3.81MM_RA_4X1]  (value not drawn)
Q5  2SC1815  [SOT23_3]
R43  100K  [RESC-0603 (1608)]
R44  100K  [RESC-0603 (1608)]
R45  10K  [RESC-0603 (1608)]
R46  10K  [RESC-0603 (1608)]
R47  10K  [RESC-0603 (1608)]
R48  10K  [RESC-0603 (1608)]
R49  1R  [RESC-0603 (1608)]
R50  1R  [RESC-0603 (1608)]
R51  1R  [RESC-0603 (1608)]
R52  1R  [RESC-0603 (1608)]
R53  100K  [RESC-0603 (1608)]
R54  100K  [RESC-0603 (1608)]
R55  100K  [RESC-0603 (1608)]
R56  10K  [RES NTC 10K]
R57  470K  [RESC-0603 (1608)]
R58  470K  [RESC-0603 (1608)]
R59  1K  [RESC-0603 (1608)]
R60  1K  [RESC-0603 (1608)]
R61  10K  [RESC-0603 (1608)]
R62  200K  [RESC-0603 (1608)]
R63  68K  [RESC-0603 (1608)]
R64  470K  [RESC-0603 (1608)]
R65  100K  [RESC-0603 (1608)]
R66  100K  [RESC-0603 (1608)]
R67  1K  [RESC-0603 (1608)]
R68  1K  [RESC-0603 (1608)]
R69  330R  [RESC-0603 (1608)]
R70  NF  [RESC-0603 (1608)]
R71  NF  [RESC-0603 (1608)]
R72  100K  [RESC-0603 (1608)]
R73  1M  [RESC-0603 (1608)]
R74  100K  [RESC-0603 (1608)]
R75  100K  [RESC-0603 (1608)]
R76  560R  [RESC-0603 (1608)]
R77  1K  [RESC-0603 (1608)]
R78  1K  [RESC-0603 (1608)]
R79  10K  [RESC-0603 (1608)]
R80  120R  [RESC-0603 (1608)]
R81  NF  [RESC-0603 (1608)]
R82  100K  [RESC-0603 (1608)]
R83  560R  [RESC-0603 (1608)]
R84  10K  [RESC-0603 (1608)]
R85  100K  [RESC-0603 (1608)]
R86  5K1  [RESC-0603 (1608)]
R87  5K1  [RESC-0603 (1608)]
R88  0R  [RESC-0603 (1608)]
R89  NF  [RESC-0603 (1608)]
R90  NF  [RESC-0603 (1608)]
R91  NF  [RESC-0603 (1608)]
R92  NF  [RESC-0603 (1608)]
R93  10K  [RESC-0603 (1608)]
R94  5K1  [RESC-0603 (1608)]
R95  5K1  [RESC-0603 (1608)]
R96  10K  [RESC-0603 (1608)]
R97  5K1  [RESC-0603 (1608)]
R98  5K1  [RESC-0603 (1608)]
R99  100R/10ppm  [RESC-0805 (2012)]
R100  4K7  [RESC-0603 (1608)]
R101  20K  [RESC-0603 (1608)]
R102  15K/10ppm  [RESC-0603 (1608)]
R103  15K/10ppm  [RESC-0603 (1608)]
R104  15K/10ppm  [RESC-0603 (1608)]
R105  10K  [RESC-0603 (1608)]
R106  200R  [RESC-0603 (1608)]
R107  0R  [RESC-0603 (1608)]
R108  5K1  [RESC-0603 (1608)]
R109  5K1  [RESC-0603 (1608)]
R110  100R/10ppm  [RESC-0805 (2012)]
R111  12K/10ppm  [RESC-0603 (1608)]
R112  1M  [RESC-0603 (1608)]
R113  100R/10ppm  [RESC-0805 (2012)]
R114  10K  [RESC-0603 (1608)]
R115  4K7  [RESC-0603 (1608)]
R116  20K  [RESC-0603 (1608)]
R117  10K  [RESC-0603 (1608)]
R118  1M  [RESC-0603 (1608)]
R119  1K  [RESC-0603 (1608)]
R120  1K  [RESC-0603 (1608)]
R121  100K  [RESC-0603 (1608)]
R122  100K  [RESC-0603 (1608)]
R123  10K  [RESC-0603 (1608)]
R124  10K  [RESC-0603 (1608)]
R125  1K  [RESC-0603 (1608)]
R126  1K  [RESC-0603 (1608)]
R127  100K  [RESC-0603 (1608)]
R128  100K  [RESC-0603 (1608)]
U10  INA180A2  [SOT23-5]
U11  INA180A2  [SOT23-5]
U12  INA180A2  [SOT23-5]
U13  INA180A2  [SOT23-5]
U14  STM32L071RZT6TR  [LQFP-64]  (parts A,B of 2)
U15  W25Q80DLZPIG TR  [WSON-8 6X5MM]
U16  RS485  [SOIC8]
U17  NF  [Lora1276 V1.2]
U18  REF3040AIDBZR  [SOT23_3]
U19  SN74LVC2G240DCUR  [SN74LVC2G240DCUR]  (parts A,B of 2)
U20  OPA2333  [8VSSOP]  (parts A,B of 2)
U21  SN74LVC2G240DCUR  [SN74LVC2G240DCUR]  (parts A,B of 2)
X1  32.768KHz  [CRYSTAL_ABS06 2x1.2mm]

### Blocks framed on the sheet
4-20mA INPUT1: C40 C46 D9 L6 P9 R46 R50 U11
4-20mA INPUT2: C41 C47 L7 P6 R47 R51 U12
4-20mA INPUT3: C39 C45 L5 P7 R45 R49 U10
4-20mA INPUT4: C42 C48 L8 P8 R48 R52 U13
FLASH: C52 R61 U15
PWM INPUT1+2: O1-O6 P10 P12-P14 R54 R55 R59 R60 R65-R68 R70 R74 R75 R77 R78 R81
RS485: C57 D12 F2 F3 P16 R76 R79 R80 R83 R85 U16
OPTO INPUT: O7-O10 P17 P18 R84 R86 R87 R89 R93-R98 R105 R108 R109
LORA: AT2 C59 R88 R90-R92 U17
4-20mA OUTPUT: C60-C65 D13-D15 P19 Q5 R99-R104 R106 R107 R110-R113 R115 R116 R118 U18-U21
OUTPUT TRANS: D16-D19 P20 P21 R114 R117 R119-R128

### Ports
CHARGE_EN (out), EN_GSM (out), ENLORA (out), GSM_EN (out), GSM_PWKEY (out), GSM_RESET (out), MCU_RX0 (in), MCU_TX0 (out)

### Nets
+3V3: C52.2 C53.2 C54.2 C55.2 C56.2 D8.2(S) D11.1(A) D12.2(S) L9.1 P11.1 R44.2 R54.2 R55.2 R59.1 R60.1 R61.1 R65.2 R66.2 R67.1 R68.1 R73.1 R74.2 R75.2 R77.1 R78.1 R82.2 R84.2 R85.2 R93.2 R96.2 R105.2 U14.1(VDD) U14.19(VDD) U14.32(VDD) U14.48(VDDIO12) U14.64(VDD) U15.3(WP/IO2) U15.7(HOLD#/IO3) U15.8(VCC)
+4V2: C60.2 U18.1(IN)
AGND: C39.2 C40.2 C41.2 C42.2 C45.1 C46.1 C47.1 C48.1 D9.1(A) L5.2 L6.2 L7.2 L8.2 R49.1 R50.1 R51.1 R52.1 U10.2(GND) U10.4(IN-) U11.2(GND) U11.4(IN-) U12.2(GND) U12.4(IN-) U13.2(GND) U13.4(IN-)
GND: AT2.2 C43.2 C44.1 C49.1 C50.1 C51.1 C52.1 C53.1 C54.1 C55.1 C56.1 C57.2 C59.2 C60.1 C61.2 C63.2 C65.2 D10.2(K) D16.2(S) D17.2(S) D18.2(S) D19.2(S) L5.1 L6.1 L7.1 L8.1 L10.1 O1.3 O2.3 O3.3 O4.3 O5.3 O6.3 O7.3 O8.3 O9.3 O10.3 P10.2 P11.3 P13.2 P15.3 P15.4 P20.4 P21.4 R43.1 R53.1 R62.1 R63.1 R64.1 R71.1 R72.1 R76.2 R90.1 R91.1 R110.1 R113.2 R121.1 R122.1 R127.1 R128.1 U14.18(VSS) U14.31(VSS) U14.47(VSS) U14.63(VSS) U15.4(GND) U16.5(GND) U17.2(GND) U17.9(GND) U17.16(GND) U18.3(GND) U19.1(~{OE}) U19.4(GND) U19.7(~{OE}) U20.4(VSS) U20.6(IN-) U21.1(~{OE}) U21.4(GND) U21.7(~{OE})
GNDA: C58.1 L10.2 U14.12(VSSA)
MASS1: C44.2 R43.2
MASS2: C49.2 R53.2
V_NTC: R56.2 U14.58(PB6)
VBAT: P10.1 P13.1 R58.2  [also labelled VEXT]
VCC_AIN: C39.1 C40.1 C41.1 C42.1 C43.1 D8.3(D) U10.5(VS) U11.5(VS) U12.5(VS) U13.5(VS)
VCC_LORA: C59.1 R92.2 U17.3(VCC)
VCC_RS485: C57.1 D12.3(D) R79.2 R83.1 U16.8(VCC)
VDDA: C58.2 L9.2 U14.13(VDDA)
VIN 16V: R57.2 R89.1
VIN 24V1: D9.2(K) P6.2 P7.2 P8.2 P9.2
VIN_OPTO: P17.1 R86.1 R89.2 R94.1 R97.1 R108.1
VREF: C61.1 U18.2(OUT) U19.8(VCC) U20.8(VCC) U21.8(VCC)
4-20mA IN1: C46.2 R46.1 U14.23(PA7/ADC7)
4-20mA IN2: C47.2 R47.1 U14.22(PA6/ADC6)
4-20mA IN3: C45.2 R45.1 U14.21(PA5/ADC5)
4-20mA IN4: C48.2 R48.1 U14.11(PC3/ADC13)
4-20mA INPUT1: P9.1 R50.2 U11.3(IN+)
4-20mA INPUT2: P6.1 R51.2 U12.3(IN+)
4-20mA INPUT3: P7.1 R49.2 U10.3(IN+)
4-20mA INPUT4: P8.1 R52.2 U13.3(IN+)
4-20mA OUT: R107.2 U14.17(PA3/ADC3) U19.2(A)
A: F3.2 P16.2
ADC_24V: R57.1 R63.2 U14.15(PA1/ADC1)
ADC_VBAT: R58.1 R64.2 U14.9(PC1/ADC11)
B: F2.2 P16.1
BUSY: U14.26(PB0/ADC8/VREFOUT) U17.10(BUSY)
CIR1: O3.2 P12.3 R70.1
CIR2: O6.2 P14.3 R81.1
CIRIN1: O3.4 R65.1 R70.2 U14.5(PH0/OSCIN)
CIRIN2: O6.4 R75.1 R81.2 U14.6(PH1/OSCOUT)
DIR1: O5.2 P12.2
DIR2: O2.2 P14.2
DIRIN1: O5.4 R74.1 U14.38(PC7)
DIRIN2: O2.4 R55.1 U14.40(PC9)
EN_4-20mA IN: D8.1(G) R44.1 U14.16(PA2/ADC2)
EN_LORA: U14.2(PC13/WKUP2) ; port ENLORA
EN_RS485: D12.1(G) R85.1 U14.54(PD2)
GSM1_RX: U14.42(PA9) ; port MCU_TX0
GSM1_TX: U14.43(PA10) ; port MCU_RX0
LED1: R69.2 U14.57(PB5)
MCU_RX2: U14.30(PB11) U16.1(R)
MCU_TX2: U14.29(PB10) U16.4(D)
OPTO1: O7.2 P17.2
OPTO2: O8.2 P17.3
OPTO3: O9.2 P18.1
OPTO4: O10.2 P18.2
OPTO_IN1: O7.4 R84.1 U14.8(PC0/ADC10)
OPTO_IN2: O8.4 R93.1 U14.20(PA4/ADC4)
OPTO_IN3: O9.4 R96.1 U14.28(PB2)
OPTO_IN4: O10.4 R105.1 U14.56(PB4)
OSC32IN: C50.2 U14.3(PC14/OSC32IN) X1.1(OSC1)
OSC32OUT: C51.2 U14.4(PC15/OSC32OUT) X1.2(OSC2)
OUTPUT1: D16.3(D) P20.2 R114.1
OUTPUT2: D17.3(D) P20.3 R117.1
OUTPUT3: D18.3(D) P21.2 R123.1
OUTPUT4: D19.3(D) P21.3 R124.1
PWM1: O1.2 P12.1
PWM2: O4.2 P14.1
PWMIN1: O1.4 R54.1 U14.35(PB14)
PWMIN2: O4.4 R66.1 U14.39(PC8)
RS485: R79.1 U14.59(PB7) U16.2(~{RE}) U16.3(DE)
SPI1_CLK: U14.55(PB3) U17.12(SCK)
SPI1_CS: U14.27(PB1/ADC9/VREFOUT) U17.15(NSS)
SPI1_MISO: U14.44(PA11/DM) U17.13(MISO)
SPI1_MOSI: U14.45(PA12/DP) U17.14(MOSI)
SPI2_CLK: U14.34(PB13) U15.6(SCK)
SPI2_CS: R61.2 U14.33(PB12) U15.1(CS#)
SPI2_MISO: U14.10(PC2/ADC12) U15.2(SO/IO1)
SPI2_MOSI: U14.36(PB15) U15.5(SI/IO0)
SWDCLK: P11.2 U14.49(PA14/SWDCLK)
SWDIO: P11.4 U14.46(PA13/SWDIO)
TRANS_OUT1: R119.1 U14.61(PB8)
TRANS_OUT2: R120.1 U14.51(PC10)
TRANS_OUT3: R125.1 U14.52(PC11)
TRANS_OUT4: R126.1 U14.53(PC12)
V_OUTPUT12: P20.1 R114.2 R117.2
V_OUTPUT34: P21.1 R123.2 R124.2
Vin 4-20mA: D13.1(A) D14.2(K) P19.2
WKUP1: P15.1 P15.2 R82.1 U14.14(PA0/ADC0/WKUP1)
NetAT2_1: AT2.1(Signal) R88.2 R90.2
NetC62_1: C62.1 R102.2 R103.1
NetC62_2: C62.2 R104.1 U20.1(OUT) U20.2(IN-)
NetC63_1: C63.1 R103.2 U20.3(IN+)
NetC64_1: C64.1 C65.1 R101.2 R102.1
NetC64_2: C64.2 R116.2
NetD10_1: D10.1(A) R69.1
NetD11_2: D11.2(K) R71.2
NetD13_2: D13.2(K) R99.2
NetD14_1: D14.1(A) D15.2(K) P19.1
NetD15_1: D15.1(A) R111.1 R113.1
NetD16_1: D16.1(G) R119.2 R121.2
NetD17_1: D17.1(G) R120.2 R122.2
NetD18_1: D18.1(G) R125.2 R127.2
NetD19_1: D19.1(G) R126.2 R128.2
NetF2_1: F2.1 R76.1 R80.2 U16.7(B)
NetF3_1: F3.1 R80.1 R83.2 U16.6(A)
NetO1_1: O1.1 R59.2
NetO2_1: O2.1 R60.2
NetO3_1: O3.1 R67.2
NetO4_1: O4.1 R68.2
NetO5_1: O5.1 R77.2
NetO6_1: O6.1 R78.2
NetO7_1: O7.1 R87.2
NetO8_1: O8.1 R95.2
NetO9_1: O9.1 R98.2
NetO10_1: O10.1 R109.2
NetQ5_1: Q5.1(B) R106.2
NetQ5_2: Q5.2(E) R110.2
NetQ5_3: Q5.3(C) R99.1
NetR3_2: U14.50(PA15) ; port GSM_EN
NetR10_2: U14.24(PC4/ADC14) ; port CHARGE_EN
NetR28_1: U14.37(PC6) ; port EN_GSM
NetR31_1: U14.62(PB9) ; port GSM_RESET
NetR32_1: U14.41(PA8) ; port GSM_PWKEY
NetR45_2: R45.2 U10.1(VOUT)
NetR46_2: R46.2 U11.1(VOUT)
NetR47_2: R47.2 U12.1(VOUT)
NetR48_2: R48.2 U13.1(VOUT)
NetR56_1: R56.1 R62.2 U14.25(PC5/ADC15)
NetR72_2: R72.2 U14.60(BOOT0)
NetR73_2: R73.2 U14.7(NRST)
NetR86_2: R86.2 R87.1
NetR88_1: R88.1 R91.2 U17.1(ANT)
NetR92_1: R92.1 U17.4(NRESET)
NetR94_2: R94.2 R95.1
NetR97_2: R97.2 R98.1
NetR100_1: R100.1 U19.3(Y)
NetR100_2: R100.2 R101.1 R112.2
NetR104_2: R104.2 R111.2 U20.5(IN+)
NetR106_1: R106.1 U20.7(OUT)
NetR107_1: R107.1 U21.2(A)
NetR108_2: R108.2 R109.1
NetR112_1: R112.1 U21.3(Y)
NetR115_1: R115.1 U19.5(A) U19.6(Y)
NetR115_2: R115.2 R116.1 R118.2
NetR118_1: R118.1 U21.5(A) U21.6(Y)

Not connected (* = marked no-connect by the designer): U17 5(TXEN) 6(DIO1) 7(DIO2) 8(DIO3) 11(RXEN)

### Notes on the sheet
- Labels drawn without touching a wire or pin: OUT 4-20mA
- File:
- Project:
- REV:
- Sheet:
- Drawn By:
- Size:
- A2
- DRAFT
- Checked By:
- Approved By:
- (in symbol 01M1002JF) +t
- (in symbol ABS06-107-32.768kHz-T) 32K

### Library data of the parts
AT2 = GKZS-SMAJZM-KWE-17.3: MFR: GAOKE; Solder: WAVE; MPN: GKZS-SMAJZM-KWE-17.3; Value: SMA
C39-C42 C44 C49 C52-C56 C58 C60 = C0603C104K5RACTU: CAP CER 0.1uF 50V 10% X7R 0603; Solder: SMT; Company ID: VT00574; MPN: C0603C104K5RACTU; Value: 104/50V
C43 C61 = CL10A106KP8NNNC: as C25 on sheet 03. Power; MPN: CL10A106KP8NNNC; Value: 106/10V
C45-C48 = CC0603KRX7R7BB103: as C10 on sheet 03. Power; MPN: CC0603KRX7R7BB103; Value: 103/16V
C50 C51 = CL10C100JB8NNND: CAP CER 10pF 5% 50V NP0 0603; Solder: SMT; Company ID: VT00076; Value: 10p/50V; MPN: CL10C100JB8NNND
C57 = CC0603JRX7R9BB223: CAP CER 0.022uF 5% 50V X7R 0603; Solder: SMT; MPN: CC0603JRX7R9BB223; Value: 223/50V
C59 = T520B227M006ATE035: CAP TANT POLY 220uF 20% 6.3V 3528 35mOhm ESR; Solder: SMT; Value: 227/6.3V; Company ID: VT00099; MPN: T520B227M006ATE035
C62-C65 = GMC10CG103J25NT: CAP CER 0.01UF 25V C0G/NP0 0603; MFR: CAL-CHIP ELECTRONICS, INC.; MPN: GMC10CG103J25NT; Solder: Cap-0603; Value: 103/25V; Category: Capacitor; Company ID: *
D8 D12 = AO3415: as D5 on sheet 03. Power; CATEGORY: DIODE; SOLDER: SOT23; VALUE: 20V/4A; MPN: AO3415
D9 D14 = P4SMAJ26: TVS DIODE 26VWM 46.6VC SMA/DO214; MFR: Diotec Semiconductor; Solder: SMT; Value: 26V/8.6A; MPN: P4SMAJ26; Category: Diode
D10 = OVLBG4C7: LED GREEN CLEAR 3MM ROUND T/H; Solder: WAVE; MPN: OVLBG4C7; Value: LED GREEN
D11 = WP710A10SRC/E: LED RED CLEAR 3MM ROUND T/H; Solder: WAVE; Value: LED RED; MPN: WP710A10SRC/E
D13 D15 = SS34: DIODE SCHOTTKY 40V 3A SMA; MFR: onsemi; Solder: SMT; Company ID: VT00542; MPN: SS34; Value: SS34
D16-D19 = DMN6140L-13: MOSFET N-CH 60V 1.6A SOT23; MFR: Diodes Incorporated; Company ID: VT00176; MPN: DMN6140L-13; Category: MOSFET; Solder: SOT23
F2 F3 = 0ZCK0075FF2E: PTC RESET FUSE 6V 750MA 0805; Manufacturer: Bel Fuse Inc.; Solder: SMT; MPN: 0ZCK0075FF2E; Category: Fuse; Value: 6V/0.75A
L5-L10 = FBMJ1608HM230NT: IND-FERRITE BEAD 23 OHM  4A 0603 1LN; Solder: SMT; Company ID: VT00326; MPN: FBMJ1608HM230NT; Value: 23R/4A
O1-O10 = LTV-816S-TA1: OPTOISOLATR 5KV TRANSISTOR 4-SMD; MFR: Lite-On Inc.; Solder: SMD 4P; MPN: LTV-816S-TA1; Value: LTV-816S-TA1; Category: Opto
P6-P10 P13 P16 P18 P19 = 15EDG3.81-2P: as P1 on sheet 03. Power; MPN: 15EDG3.81-2P; Value: 15EDG3.81-2P; Company ID: *; MPN2: CLA5048
P11 = Header 4x1: Header, 4 Pin Pitch 2.54mm; MPN: S1012EC-40-ND; Company ID: VT-00125; Solder: WAVE; Value: Header 4P
P12 P14 P17 = 15EDG3.81-3P: Pluggable terminal 15EDG- 3P 3.81MM; MFR: China; Solder: Hand; MPN: 15EDG3.81-3P; Value: 15EDG3.81-3P; Company ID: *; MPN2: CLA5050
P15 = Button 4P: MPN: CLA1773; MFR: China Brand; Solder: Wave; Company ID: VT00544; Category: Button
P20 P21 = 15EDG3.81-4P: Pluggable terminal 15EDG- 4P 3.81MM; MFR: China; Solder: Hand; MPN: 15EDG3.81-4P; Value: 15EDG3.81-4P; Company ID: *; MPN2: CLA5052
Q5 = 2SC1815: TRANS NPN 50V 0.15A SOT23-3; Solder: SMT; Company ID: VT00492; MPN: 2SC1815; Value: 2SC1815; Category: Transistor
R43 R44 R53-R55 R65 R66 R72 R74 R75 R82 R85 R121 R122 R127 R128 = RC0603FR-07100KL: as R3 on sheet 03. Power; MPN: RC0603FR-07100KL; Value: 100K
R45-R48 R61 R79 R84 R92 R93 R96 R105 R114 R117 R123 R124 = RC0603FR-0710KL: RES SMD 10K OHM 1% 1/10W 0603; Solder: SMT; Company ID: VT00426; MPN: RC0603FR-0710KL; Value: 10K
R49-R52 = TNPW06031R00DEEA: RES 1 OHM 0.5% 1/8W 0603; Solder: SMT; Temperature Coefficient: 25ppm/C; MPN: TNPW06031R00DEEA; Value: 1R
R56 = 01M1002JF: THERMISTOR NTC 10KOHM 3964K BEAD; MFR: Vishay; Solder: Wave; MPN: 01M1002JF; Value: 10K; Category: RESISTOR
R57 R58 R64 = RC0603FR-07470KL: RES SMD 470K OHM 1% 1/10W 0603; Solder: SMT; Company ID: VT00448; Value: 470K; MPN: RC0603FR-07470K
R59 R60 R67 R68 R77 R78 R119 R120 R125 R126 = RC0603FR-071KL: as R17 on sheet 03. Power; MPN: RC0603FR-071KL; Value: 1K
R62 = CR0603-FX-2003ELF: RES SMD 200K OHM 1% 1/10W 0603; MPN: CR0603-FX-2003ELF; VALUE: 200K; Category: Resistor
R63 = CRCW060368K0FKEA: RES SMD 68K OHM 1% 1/10W 0603; Solder: SMT; MPN: CRCW060368K0FKEA; Value: 68K
R69 = RC0603FR-07330RL: RES SMD 330 OHM 1% 1/10W 0603; Solder: SMT; Company ID: VT00443; Value: 330R; MPN: RC0603FR-07330RL
R70 R81 R89 = RC0603FR-070R: RES SMD 0 OHM 1% 1/10W 0603; Solder: SMT; Value: 0R; Company ID: VT00423; MPN: RC0603FR-070R
R71 = RC0603FR-07180RL: RES SMD 180 OHM 1% 1/10W 0603; Value: 180R; Solder: SMT; Company ID: VT00430; MPN: RC0603FR-07180RL
R73 = CRCW06031M00FKEA: as R1 on sheet 03. Power; MPN: CRCW06031M00FKEA; Value: 1M
R76 R83 = RC0603FR-07560RL: RES SMD 560 OHM 1% 1/10W 0603; Solder: SMT; Company ID: VT00455; MPN: RC0603FR-07560RL; Value: 560R
R80 = RC0603FR-07120RL: RES SMD 120 OHM 1% 1/10W 0603; Solder: SMT; Company ID: VT00427; MPN: RC0603FR-07120RL; Value: 120R
R86 R87 R94 R95 R97 R98 R108 R109 = RC0603FR-075K1L: RES SMD 5.1K OHM 1% 1/10W 0603; MFR: Yageo; Company ID: VT00457; MPN: RC0603FR-075K1L; CATEGORY: RESISTOR; VALUE: 5K1
R88 = RC0603FR-070RL: RES SMD 0.0OHM JUMPER 1/10W 0603; Solder: SMT; Company ID: VT00423; MPN: RC0603FR-070RL; Value: 0R
R90 R91 = RC0603FR-070RL: RES SMD 0.0OHM JUMPER 1/10W 0603; Value: 0R; Solder: SMT; Company ID: VT00423; MPN: RC0603FR-070RL
R99 R110 R113 = RT0805BRB07100RL: RES SMD 100 OHM 0.1% 1/8W 0805; MFR: Yageo; Solder: RES-0805; MPN: RT0805BRB07100RL; Value: 100R/10ppm; Category: Resistor; Company ID: *
R100 R115 = RC0603FR-074K7L: RES SMD 4.7K OHM 1% 1/10W 0603; Solder: SMT; Company ID: VT00451; MPN: RC0603FR-074K7L; Value: 4K7
R101 R116 = RC0603FR-0720KL: RES SMD 20K OHM 1% 1/10W 0603; Solder: SMT; Company ID: VT00436; MPN: RC0603FR-0720KL; Value: 20K
R102-R104 = RT0603BRB0715KL: RES SMD 15K OHM 0.1% 1/10W 0603 10PPM; MFR: Yageo; Value: 15K/10ppm; MPN: RT0603BRB0715KL; CATEGORY: RESISTOR; SOLDER: RES-0603; COMPANY ID: *
R106 = AC0603FR-07200RL: RES SMD 200 OHM 1% 1/10W 0603; MFR: YAGEO; MPN: AC0603FR-07200RL; CATEGORY: RESISTOR; SOLDER: RES-0603; Value: 200R; COMPANY ID: *
R107 = RC0603FR-070RL: RES SMD 0.0OHM JUMPER 1/10W 0603; MFR: Yageo; Solder: SMT; Company ID: VT00423; MPN: RC0603FR-070RL; Value: 0R; Category: Resistor
R111 = TNPW060312K0BYEN: RES 12K OHM 0.1% 1/8W 0603; MFR: Vishay Dale; Solder: SMT; MPN: TNPW060312K0BYEN; Value: 12K/10ppm; Category: RESISTOR
R112 R118 = CRCW06031M00FKEA: RES SMD 1M OHM 1% 1/10W 0603; MFR: Vishay Dale; Solder: SMT; Company ID: VT00405; MPN: CRCW06031M00FKEA; Value: 1M; Category: Resistor
U10-U13 = INA180A2IDBVT: IC CURR SENSE 1 CIRCUIT SOT23-5; MFR: TI; MPN: INA180A2IDBVT; Category: IC; Solder: SOT23-5; Company ID: *; Value: INA180A2
U14 = STM32L071RZT6TR: IC MCU 32BIT 192KB FLASH 64LQFP; MFR: ST; MPN: STM32L071RZT6TR; CATEGORY: IC; SOLDER: 64 LQFP; Value: STM32L071RZT6TR; COMPANY ID: *
U15 = W25Q80DLZPIG TR: IC FLSH 8MBIT SPI/QUAD I/O 8WSON; MFR: Winbond Electronics; Solder: SMT; MPN: W25Q80DLZPIG TR; Value: W25Q80DLZPIG TR; Category: IC; Company ID: *
U16 = SN65HVD72DR: IC TRANSCEIVER HALF 1/1 8SOIC; MFR: TI; SOLDER: SOIC-8; MPN: SN65HVD72DR; CATEGORY: IC; VALUE: RS485
U17 = RA-01S: Module lora RA-01S SX1268; MFR: AI-THINKER; Solder: SMT 16; MPN: RA-01S; Category: Module; Value: RA-01S
U18 = REF3040AIDBZR: IC VREF SHUNT ADJ SOT23-3; MFR: TI; Solder: SOT-23; MPN: REF3040AIDBZR; Value: REF3040AIDBZR; Category: IC; Company ID: *
U19 U21 = SN74LVC2G240DCUR: 2-ch, 1.65-V to 5.5-V inverters with 3-state outputs; MFR: TI; Solder: VSSOP; MPN: SN74LVC2G240DCUR; Category: IC; Value: SN74LVC2G240DCUR
U20 = OPA2333AIDGKR: OPA2333 1.8V, 17A, 2 CHANNELS, M; MFR: TI; Solder: VSSOP-8; MPN: OPA2333AIDGKR; Category: IC; Value: OPA2333; Company ID: *
X1 = ABS06-107-32.768kHz-T: CRYSTAL 32.7680KHZ 4pF SMD; Solder: SMT; Company ID: VT00159; Value: 32.768KHz; MPN: ABS06-107-32.768kHz-T

## Sheet 05. 4G Module.SchDoc
size A3
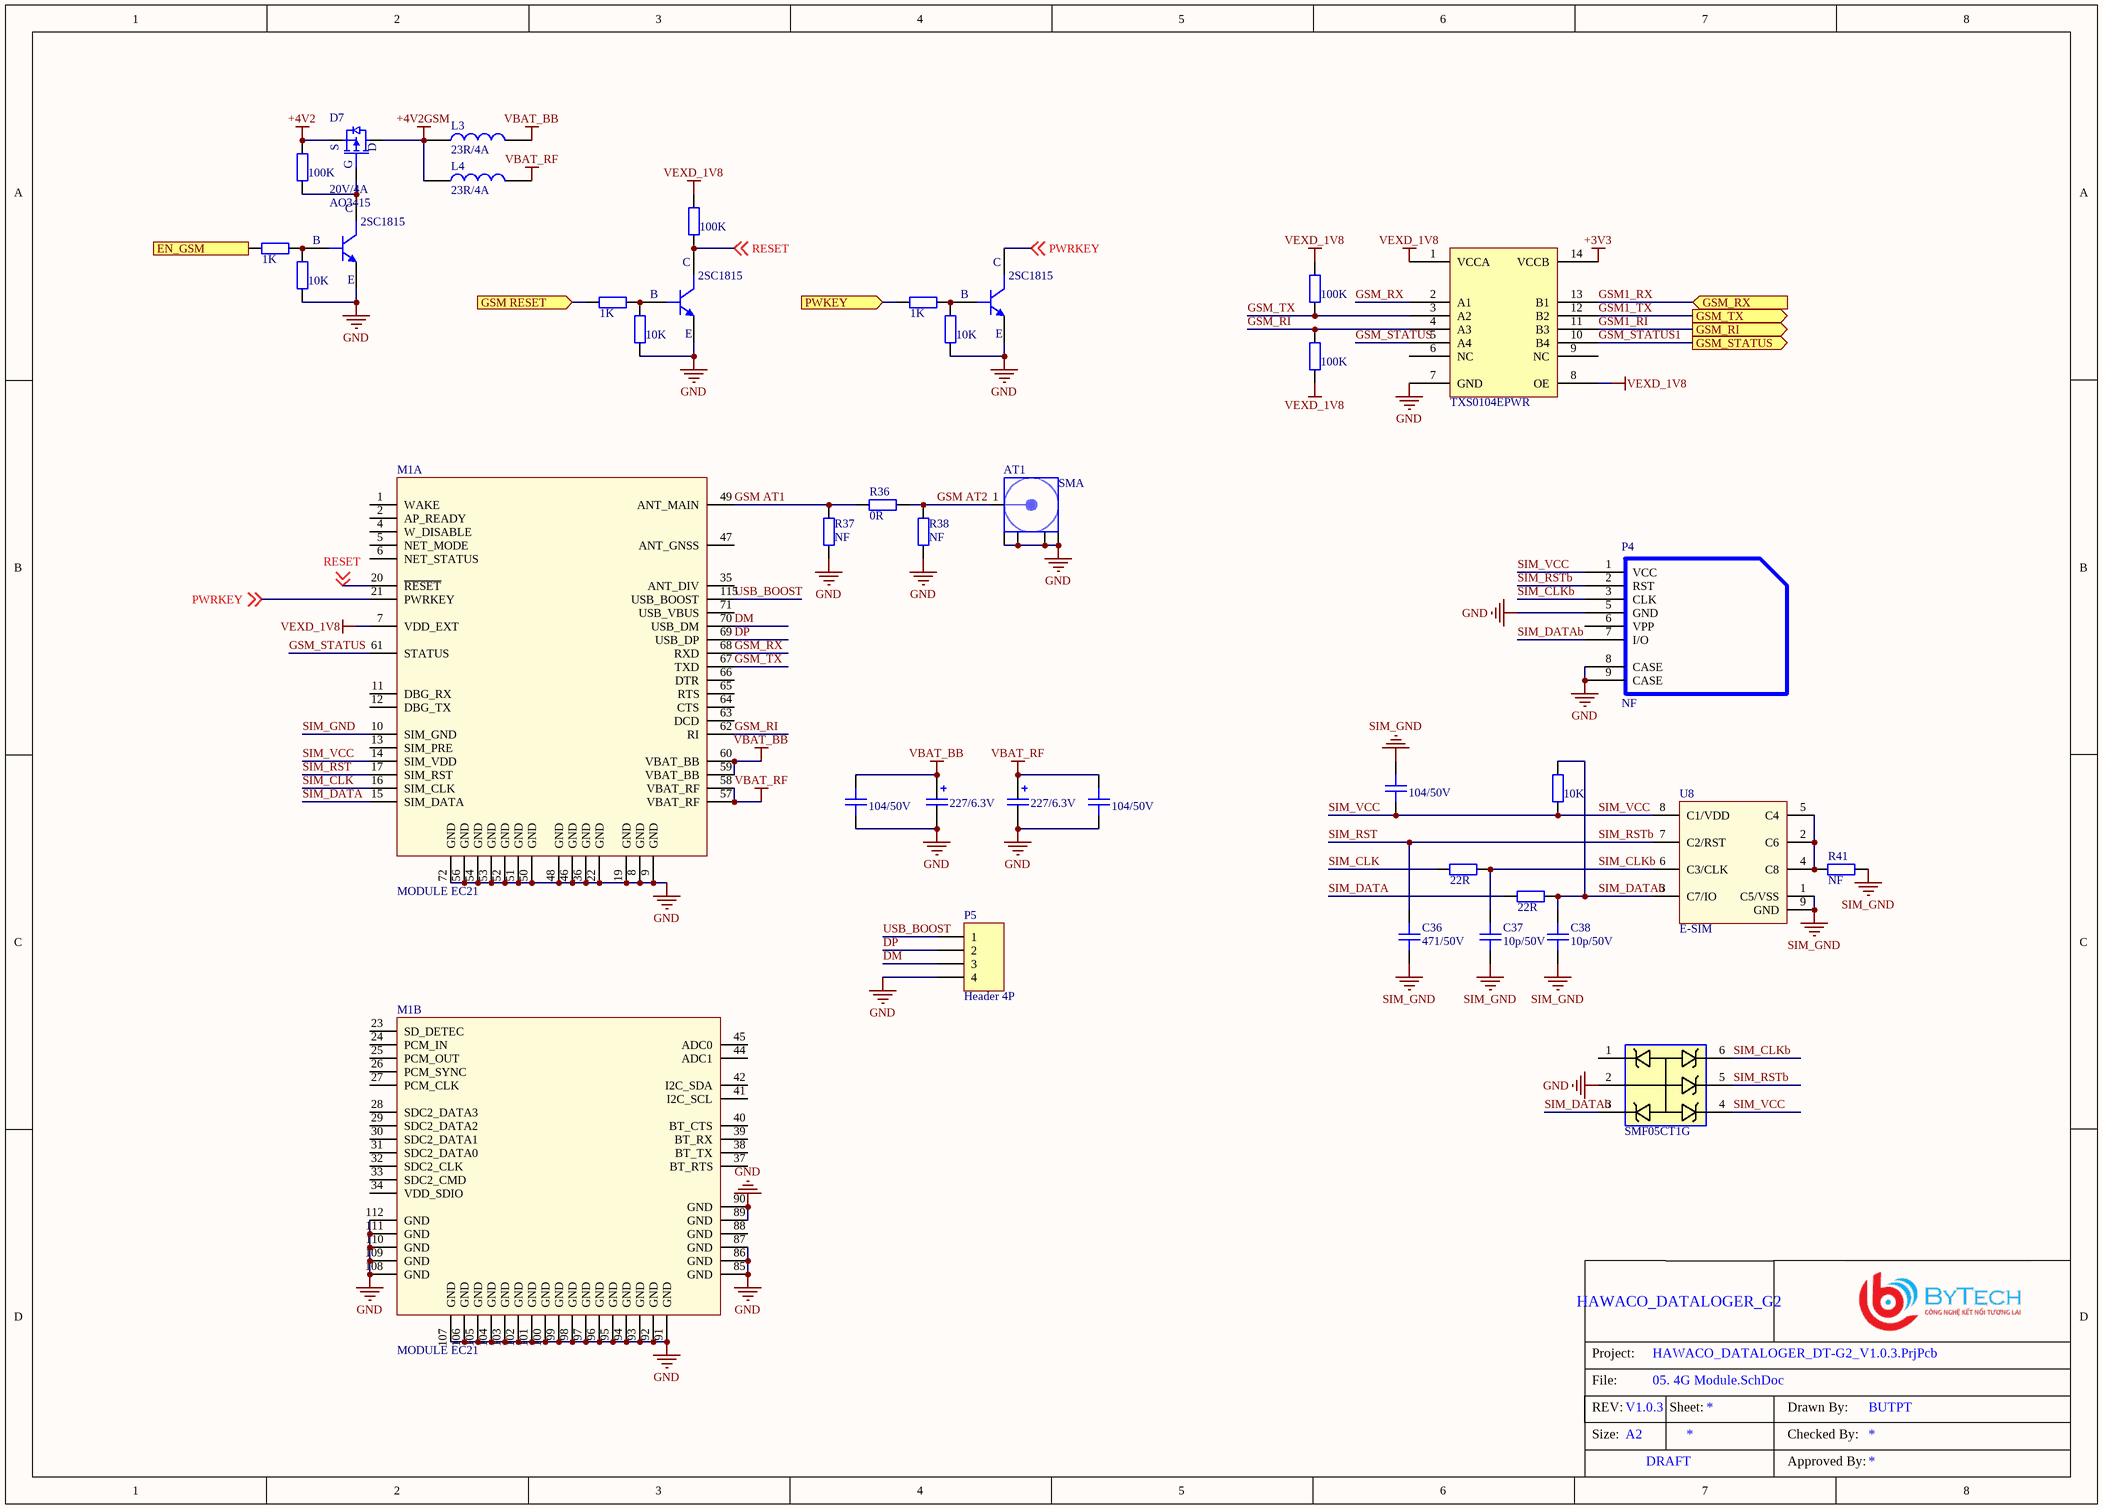
[diagram p6: 05. 4G Module.SchDoc]

### Parts
AT1  SMA  [SMA-KWE-17-V1]
C31  104/50V  [CAPC-0603 (1608)]
C32  227/6.3V  [CAP_TANTAL_1210(3528)]
C33  227/6.3V  [CAP_TANTAL_1210(3528)]
C34  104/50V  [CAPC-0603 (1608)]
C35  104/50V  [CAPC-0603 (1608)]
C36  471/50V  [CAPC-0603 (1608)]
C37  10p/50V  [CAPC-0603 (1608)]
C38  10p/50V  [CAPC-0603 (1608)]
D7  20V/4A  [SOT23_3]
L3  23R/4A  [IND-0603 (1608)]
L4  23R/4A  [IND-0603 (1608)]
M1  MODULE EC21  [EC21]  (parts A,B of 3)
P4  NF  [MUP-C792]
P5  Header 4P  [HDR1X4]
Q2  2SC1815  [SOT23_3]
Q3  2SC1815  [SOT23_3]
Q4  2SC1815  [SOT23_3]
R26  100K  [RESC-0603 (1608)]
R27  100K  [RESC-0603 (1608)]
R28  1K  [RESC-0603 (1608)]
R29  10K  [RESC-0603 (1608)]
R30  100K  [RESC-0603 (1608)]
R31  1K  [RESC-0603 (1608)]
R32  1K  [RESC-0603 (1608)]
R33  10K  [RESC-0603 (1608)]
R34  10K  [RESC-0603 (1608)]
R35  100K  [RESC-0603 (1608)]
R36  0R  [RESC-0603 (1608)]
R37  NF  [RESC-0603 (1608)]
R38  NF  [RESC-0603 (1608)]
R39  10K  [RESC-0603 (1608)]
R40  22R  [RESC-0603 (1608)]
R41  NF  [RESC-0603 (1608)]
R42  22R  [RESC-0603 (1608)]
U7  TXS0104EPWR  [TSOP65P640X120-14N]
U8  E-SIM  [MFF2 ESIM]
U9  SMF05CT1G  [SOT363]

### Ports
EN_GSM (in), GSM RESET (in), GSM_RI (out), GSM_RX (in), GSM_STATUS (out), GSM_TX (out), PWKEY (in)

### Nets
+3V3: U7.14(VCCB)
+4V2: D7.2(S) R26.2
+4V2GSM: D7.3(D) L3.1 L4.1
GND: AT1.2 C32.2 C33.2 C34.2 C35.2 M1.8(GND) M1.9(GND) M1.19(GND) M1.22(GND) M1.36(GND) M1.46(GND) M1.48(GND) M1.50(GND) M1.51(GND) M1.52(GND) M1.53(GND) M1.54(GND) M1.56(GND) M1.72(GND) M1.85(GND) M1.86(GND) M1.87(GND) M1.89(GND) M1.90(GND) M1.91(GND) M1.92(GND) M1.93(GND) M1.94(GND) M1.95(GND) M1.96(GND) M1.97(GND) M1.98(GND) M1.99(GND) M1.100(GND) M1.101(GND) M1.102(GND) M1.103(GND) M1.104(GND) M1.105(GND) M1.106(GND) M1.107(GND) M1.108(GND) M1.109(GND) M1.110(GND) M1.111(GND) M1.112(GND) P4.5(GND) P4.8(CASE) P4.9(CASE) P5.4 Q2.2(E) Q3.2(E) Q4.2(E) R29.1 R33.1 R34.1 R37.1 R38.1 U7.7(GND) U9.2(AN)
SIM_GND: C31.1 C36.1 C37.1 C38.1 M1.10(SIM_GND) R41.2 U8.1(C5/VSS) U8.9(GND)
VBAT_BB: C32.1 C34.1 L3.2 M1.59(VBAT_BB) M1.60(VBAT_BB)
VBAT_RF: C33.1 C35.1 L4.2 M1.57(VBAT_RF) M1.58(VBAT_RF)
VEXD_1V8: M1.7(VDD_EXT) R27.2 R30.2 R35.2 U7.1(VCCA) U7.8(OE)
DM: M1.70(USB_DM) P5.3
DP: M1.69(USB_DP) P5.2
GSM1_RI: U7.11(B3) ; port GSM_RI
GSM1_RX: U7.13(B1) ; port GSM_RX
GSM1_TX: U7.12(B2) ; port GSM_TX
GSM AT1: M1.49(ANT_MAIN) R36.1 R37.2
GSM AT2: AT1.1(Signal) R36.2 R38.2
GSM_RI: M1.62(RI) R35.1 U7.4(A3)
GSM_RX: M1.68(RXD) U7.2(A1)
GSM_STATUS: M1.61(STATUS) U7.5(A4)
GSM_STATUS1: U7.10(B4) ; port GSM_STATUS
GSM_TX: M1.67(TXD) R30.1 U7.3(A2)
PWRKEY: M1.21(PWRKEY) Q4.3(C) ; off-sheet PWRKEY
RESET: M1.20(~{RESET}) Q3.3(C) R27.1 ; off-sheet RESET
SIM_CLK: M1.16(SIM_CLK) R40.1
SIM_CLKb: C37.2 P4.3(CLK) R40.2 U8.6(C3/CLK) U9.6(CT5)
SIM_DATA: M1.15(SIM_DATA) R42.1
SIM_DATAb: C38.2 P4.7(I/O) R39.2 R42.2 U8.3(C7/IO) U9.3(CT2)
SIM_RST: C36.2 M1.17(SIM_RST) P4.2(RST) U8.7(C2/RST) U9.5(CT4)  [also labelled SIM_RSTb]
SIM_VCC: C31.2 M1.14(SIM_VDD) P4.1(VCC) R39.1 U8.8(C1/VDD) U9.4(CT3)
USB_BOOST: M1.115(USB_BOOST) P5.1
NetD7_1: D7.1(G) Q2.3(C) R26.1
NetQ2_1: Q2.1(B) R28.2 R29.2
NetQ3_1: Q3.1(B) R31.2 R33.2
NetQ4_1: Q4.1(B) R32.2 R34.2
NetR28_1: R28.1 ; port EN_GSM
NetR31_1: R31.1 ; port GSM RESET
NetR32_1: R32.1 ; port PWKEY
NetR41_1: R41.1 U8.2(C6) U8.4(C8) U8.5(C4)

Not connected (* = marked no-connect by the designer): M1 1(WAKE) 2(AP_READY) 4(W_DISABLE) 5(NET_MODE) 6(NET_STATUS) 11(DBG_RX) 12(DBG_TX) 13(SIM_PRE) 23(SD_DETEC) 24(PCM_IN) 25(PCM_OUT) 26(PCM_SYNC) 27(PCM_CLK) 28(SDC2_DATA3) 29(SDC2_DATA2) 30(SDC2_DATA1) 31(SDC2_DATA0) 32(SDC2_CLK) 33(SDC2_CMD) 34(VDD_SDIO) 35(ANT_DIV) 37(BT_RTS) 38(BT_TX) 39(BT_RX) 40(BT_CTS) 41(I2C_SCL) 42(I2C_SDA) 44(ADC1) 45(ADC0) 47(ANT_GNSS) 63(DCD) 64(CTS) 65(RTS) 66(DTR) 71(USB_VBUS) 88(GND); P4 6(VPP); U7 6(NC) 9(NC); U9 1(CT1)

### Notes on the sheet
- File:
- Project:
- REV:
- Size:
- A2
- Sheet:
- Drawn By:
- Checked By:
- DRAFT
- Approved By:

### Library data of the parts
AT1 = GKZS-SMAJZM-KWE-17.3: MFR: GAOKE; Solder: WAVE; MPN: GKZS-SMAJZM-KWE-17.3; Value: SMA
C31 C34 C35 = C0603C104K5RACTU: as C1 on sheet 03. Power; MPN: C0603C104K5RACTU; Value: 104/50V
C32 C33 = T520B227M006ATE035: CAP TANT POLY 220uF 20% 6.3V 3528 35mOhm ESR; Solder: SMT; CompanyID: VT-00643; Value: 227/6.3V; MPN: T520B227M006ATE035
C36 = CL10B471KB8NNNC: CAP CER 470pF 10% 50V X7R 0603; Solder: SMT; Company ID: VT00072; MPN: CL10B471KB8NNNC; Value: 471/50V
C37 C38 = CL10C100JB8NNND: as C50 on sheet 04. MCU + ANALOG; Value: 10p/50V; MPN: CL10C100JB8NNND
D7 = AO3415: as D5 on sheet 03. Power; CATEGORY: DIODE; SOLDER: SOT23; VALUE: 20V/4A; MPN: AO3415
L3 L4 = FBMJ1608HM230NT: as L5 on sheet 04. MCU + ANALOG; MPN: FBMJ1608HM230NT; Value: 23R/4A
M1 = QUECTEL EC21: Quectel EC21 is a series of LTE category; MPN: EC21-CN; SOLDER: SMT; MFR: QUECTEL; CATEGORY: IC
P4 = MUP-C792: MicroSIM Card Push - Push Holder; MFR: MUPCONNECTOR; Company ID: VT00135; Solder: SMT; MPN: MUP-C792; Value: MUP-C792
P5 = Header 4x1: as P11 on sheet 04. MCU + ANALOG; Value: Header 4P
Q2-Q4 = 2SC1815: TRANS NPN 50V 0.15A SOT23-3; Solder: SMT; MPN: 2SC1815; Value: 2SC1815
R26 R27 R30 R35 = RC0603FR-07100KL: RES SMD 100K OHM 1% 1/10W 0603; CompanyID: VT-00332; Solder: SMT; MPN: RC0603FR-07100KL; Value: 100K
R28 R31 R32 = RC0603FR-071KL: RES SMD 1 KOHM 1% 1/10W 0603; CompanyID: VT-00574; Solder: SMT; MPN: RC0603FR-071KL; Value: 1K
R29 R33 R34 R39 = RC0603FR-0710KL: as R18 on sheet 03. Power; MPN: RC0603FR-0710KL; Value: 10K
R36 = RC0603FR-070R: RES SMD 0 OHM 1% 1/10W 0603; Solder: SMT; Company ID: VT00423; Value: 0R; MPN: RC0603FR-070R
R37 R38 R41 = RC0603FR-070R: as R70 on sheet 04. MCU + ANALOG; MPN: RC0603FR-070R
R40 R42 = RC0603FR-0722RL: RES SMD 22 OHM 1% 1/10W 0603; CompanyID: VT-00881; Solder: SMT; Value: 22R; MPN: RC0603FR-0722RL
U7 = TXS0104EPWR: IC 4BIT NON-INV TRANSLTR 14TSSOP; Solder: SMT; Value: TXS0104EPWR; MPN: TXS0104EPWR; Category: IC
U8 = SCM512: M2M communication module e-sim; MFR: ATC; SOLDER: WSON-8; MPN: SCM512; CATEGORY: IC; Value: E-SIM
U9 = SMF05CT1G: TVS DIODE 5VWM 12.5VC SC88; CompanyID: VT-00105; Solder: SMT; MPN: SMF05CT1G; Value: SMF05CT1G

## Nets that join several sheets
+3V3: 03. Power (7 pins), 04. MCU + ANALOG (39 pins), 05. 4G Module (U7.14)
+4V2: 03. Power (9 pins), 04. MCU + ANALOG (C60.2 U18.1), 05. 4G Module (D7.2 R26.2)
GND: 03. Power (61 pins), 04. MCU + ANALOG (78 pins), 05. 4G Module (60 pins)
VBAT: 03. Power (C30.2 P3.2 U6.2 U6.3), 04. MCU + ANALOG (P10.1 P13.1 R58.2)
VCC_LORA: 03. Power (C16.2 C17.2 U3.5), 04. MCU + ANALOG (C59.1 R92.2 U17.3)
VIN 16V: 03. Power (10 pins), 04. MCU + ANALOG (R57.2 R89.1)
EN_LORA: 03. Power (R8.2 U3.3), 04. MCU + ANALOG (U14.2)
GSM1_RX: 04. MCU + ANALOG (U14.42), 05. 4G Module (U7.13)
GSM1_TX: 04. MCU + ANALOG (U14.43), 05. 4G Module (U7.12)
NetR3_2: 03. Power (R3.2 U1.3), 04. MCU + ANALOG (U14.50)
NetR10_2: 03. Power (R10.2 U4.3), 04. MCU + ANALOG (U14.24)
NetR28_1: 04. MCU + ANALOG (U14.37), 05. 4G Module (R28.1)
NetR31_1: 04. MCU + ANALOG (U14.62), 05. 4G Module (R31.1)
NetR32_1: 04. MCU + ANALOG (U14.41), 05. 4G Module (R32.1)